# EAGLE schematic Inferno v1 (EAGLE 5.10)

## Sheet 1 of 7
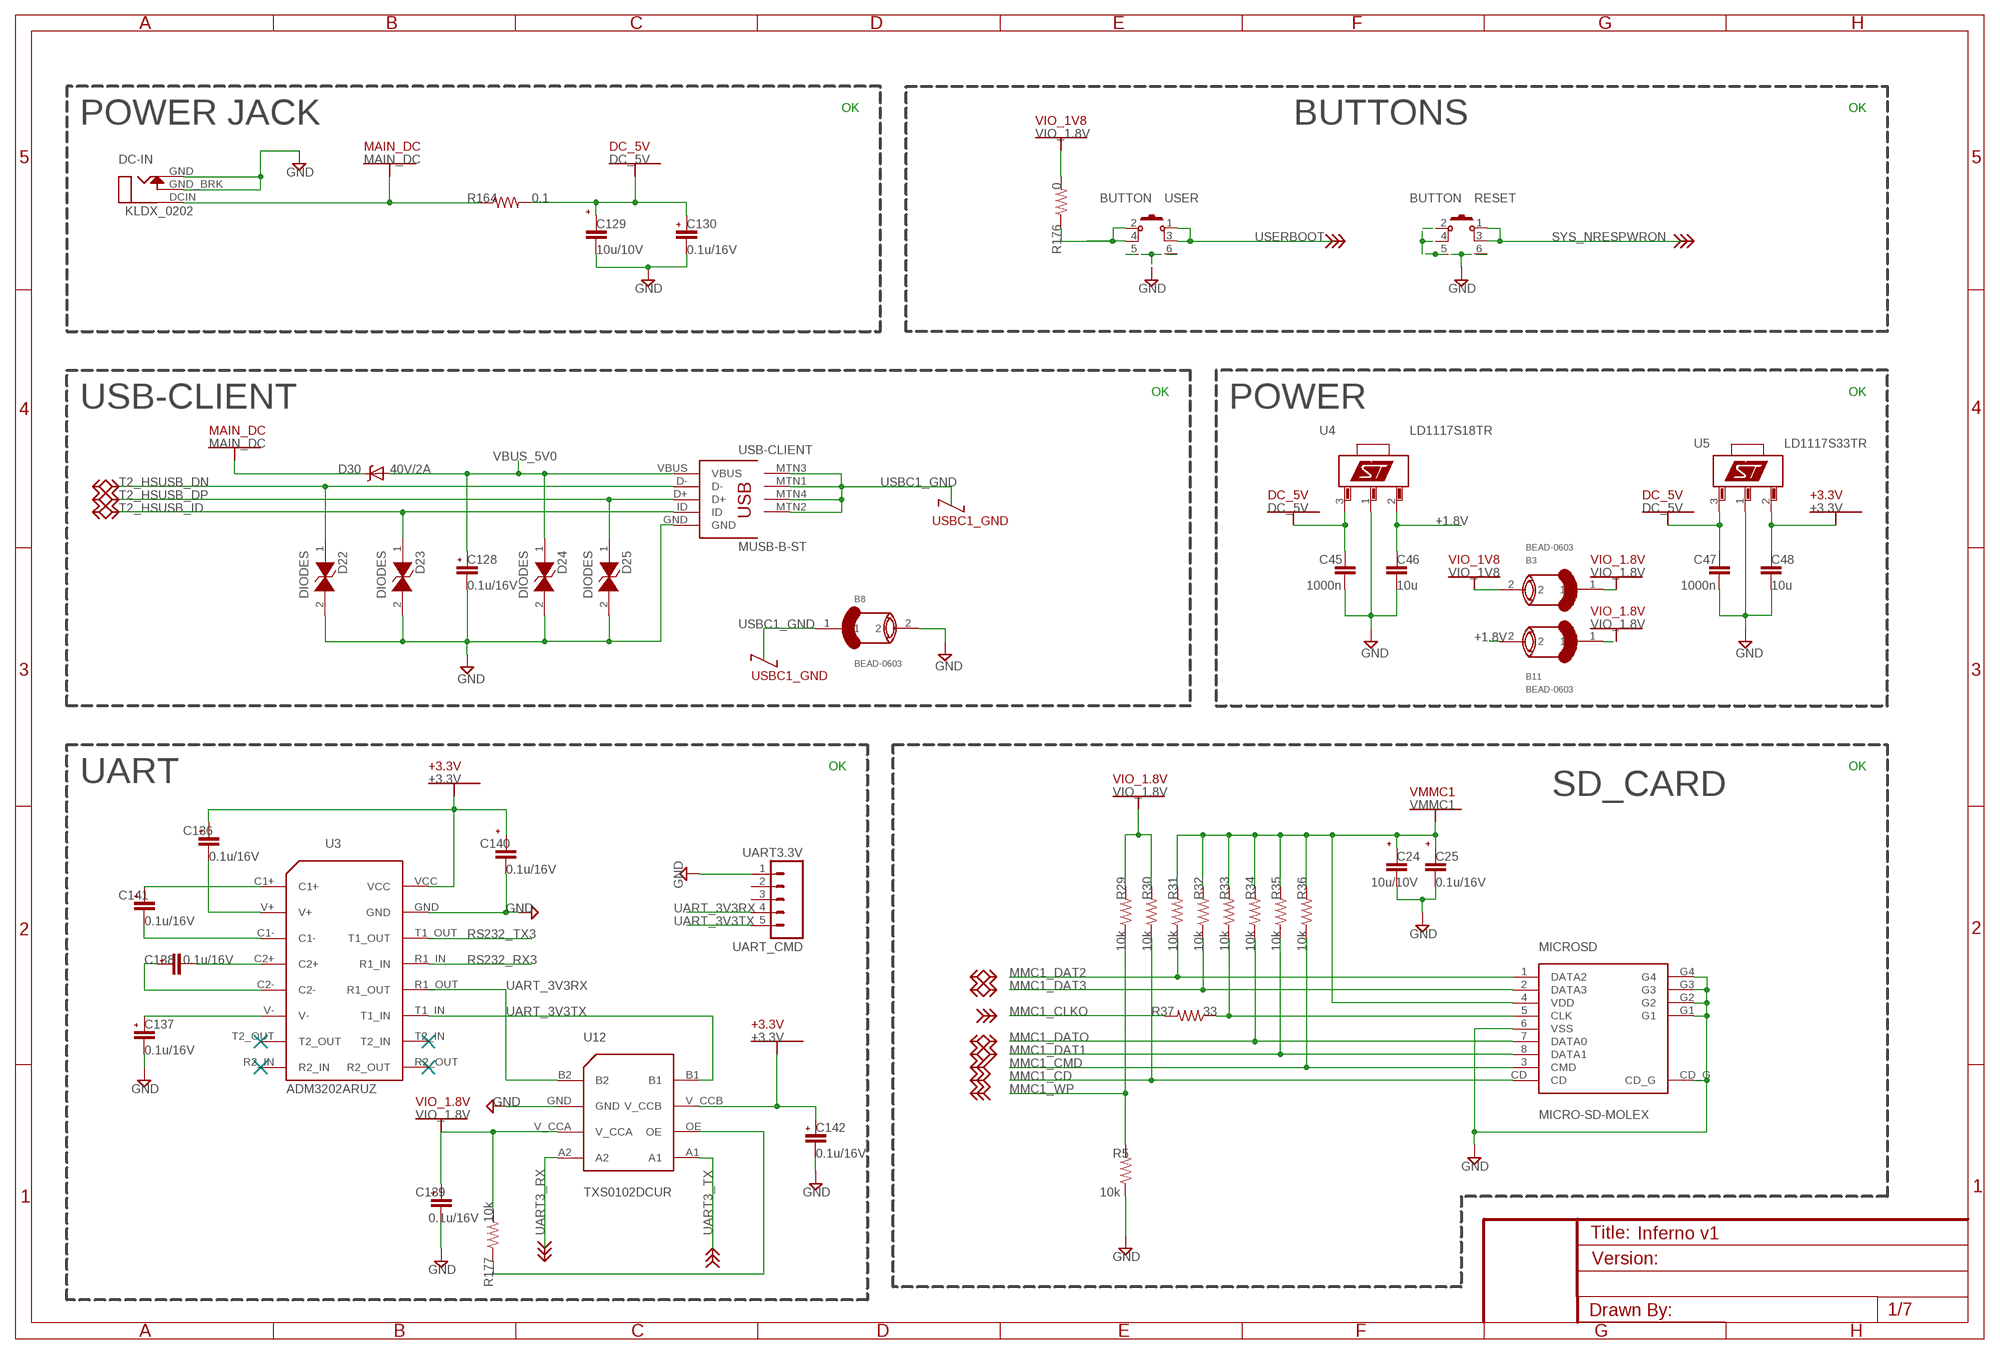
[diagram p0: schematic, sheet 1]

### Parts
B3  BEAD-0603  [0805]
B8  BEAD-0603  [0805]
B11  BEAD-0603  [0805]
C24  10u/10V  CAP0805  [0805]
C25  0.1u/16V  CAP0805  [0805]
C45  1000n  CAP0603-CAP  [0603-CAP]
C46  10u  CAP0603-CAP  [0603-CAP]
C47  1000n  CAP0603-CAP  [0603-CAP]
C48  10u  CAP0603-CAP  [0603-CAP]
C128  0.1u/16V  CAP0805  [0805]
C129  10u/10V  CAP0805  [0805]
C130  0.1u/16V  CAP0805  [0805]
C136  0.1u/16V  CAP0805  [0805]
C137  0.1u/16V  CAP0805  [0805]
C138  0.1u/16V  CAP0805  [0805]
C139  0.1u/16V  CAP0805  [0805]
C140  0.1u/16V  CAP0805  [0805]
C141  0.1u/16V  CAP0805  [0805]
C142  0.1u/16V  CAP0805  [0805]
D22  DIODES  [0603]
D23  DIODES  [0603]
D24  DIODES  [0603]
D25  DIODES  [0603]
D30  40V/2A  DIODE-SCHOTTKY_  [SMA-DIODE]
DC-IN  KLDX_0202  [KLDX_0202]
MICROSD  MICRO-SD-MOLEX  [MOLEX_MICROSD]
R5  10k  RESISTOR0603-RES  [0603-RES]
R29  10k  RESISTOR0603-RES  [0603-RES]
R30  10k  RESISTOR0603-RES  [0603-RES]
R31  10k  RESISTOR0603-RES  [0603-RES]
R32  10k  RESISTOR0603-RES  [0603-RES]
R33  10k  RESISTOR0603-RES  [0603-RES]
R34  10k  RESISTOR0603-RES  [0603-RES]
R35  10k  RESISTOR0603-RES  [0603-RES]
R36  10k  RESISTOR0603-RES  [0603-RES]
R37  33  RESISTOR0603-RES  [0603-RES]
R164  0.1  RESISTOR0603-RES  [0603-RES]
R176  0  RESISTOR0603-RES  [0603-RES]
R177  10k  RESISTOR0603-RES  [0603-RES]
RESET  BUTTON  TAC_SWITCH  [TACTILE-SW]
U3  ADM3202ARUZ  [TSSOP]
U4  LD1117S18TR  [SOT223]
U5  LD1117S33TR  [SOT223]
U12  TXS0102DCUR  [DCU]
UART_CMD  UART3.3V  M05PTH  [1X05]
USB-CLIENT  MUSB-B-ST  [USB-MINIB]
USER  BUTTON  TAC_SWITCH  [TACTILE-SW]

### Nets
+1.8V [net_VIO_1V8]: B11.2 C46.1 U4.2(VOUT)
+3.3V [net_+3.3V]: C48.1 C136.1 C140.1 C142.1 U3.VCC U5.2(VOUT) U12.V_CCB ; also sheet 4,5,7
DC_5V [net_DC_5V]: C45.1 C47.1 C129.1 C130.1 R164.2 U4.3(VIN) U5.3(VIN) ; also sheet 2,3,4,5,7
GND [net_GND]: B8.2 C24.2 C25.2 C45.2 C46.2 C47.2 C48.2 C128.2 C129.2 C130.2 C137.2 C139.2 C140.2 C142.2 D22.2 D23.2 D24.2 D25.2 DC-IN.GND DC-IN.GND_BRK MICROSD.6(VSS) MICROSD.CD_G MICROSD.G1 MICROSD.G2 MICROSD.G3 MICROSD.G4 R5.1 RESET.2 RESET.4 RESET.5(MNT1) RESET.6(MNT2) U3.GND U4.1(GND) U5.1(GND) U12.GND UART_CMD.1 USB-CLIENT.GND USER.5(MNT1) USER.6(MNT2) ; also sheet 2,3,4,5,6,7
MAIN_DC [net_MAIN_DC]: D30.C DC-IN.DCIN R164.1
MMC1_CD: MICROSD.CD R30.1 ; also sheet 4
MMC1_CLKO: R37.2 ; also sheet 4
MMC1_CMD: MICROSD.3(CMD) R36.1 ; also sheet 4
MMC1_DAT1: MICROSD.8(DATA1) R35.1 ; also sheet 4
MMC1_DAT2: MICROSD.1(DATA2) R31.1 ; also sheet 4
MMC1_DAT3: MICROSD.2(DATA3) R32.1 ; also sheet 4
MMC1_DATO: MICROSD.7(DATA0) R34.1 ; also sheet 4
MMC1_WP: R5.2 R29.1 ; also sheet 4
N$4: C141.1 U3.C1+
N$18: C141.2 U3.C1-
N$37: C136.2 U3.V+
N$53: MICROSD.5(CLK) R33.1 R37.1
N$55: C138.1 U3.C2+
N$56: C137.1 U3.V-
N$57: R177.1 U12.OE
N$58: C138.2 U3.C2-
N$188: R176.1 USER.2 USER.4
RS232_RX3: U3.R1_IN ; also sheet 4
RS232_TX3: U3.T1_OUT ; also sheet 4
SYS_NRESPWRON: RESET.1 RESET.3 ; also sheet 3,4,6
T2_HSUSB_DN: D22.1 USB-CLIENT.D- ; also sheet 4
T2_HSUSB_DP: D25.1 USB-CLIENT.D+ ; also sheet 4
T2_HSUSB_ID: D23.1 USB-CLIENT.ID ; also sheet 4
UART3_RX: U12.A2 ; also sheet 4
UART3_TX: U12.A1 ; also sheet 4
UART_3V3RX: U3.R1_OUT U12.B2 UART_CMD.4
UART_3V3TX: U3.T1_IN U12.B1 UART_CMD.5
USBC1_GND [net_USBC1_GND]: B8.1 USB-CLIENT.MTN1(MNT1) USB-CLIENT.MTN2(MNT2) USB-CLIENT.MTN3(MNT3) USB-CLIENT.MTN4(MNT4)
USERBOOT: USER.1 USER.3 ; also sheet 4
VBUS_5V0 [net_DC_5V]: C128.1 D24.1 D30.A USB-CLIENT.VBUS ; also sheet 4
VIO_1.8V [net_VIO_1V8]: B3.1 B11.1 C139.1 R29.2 R30.2 R176.2 R177.2 U12.V_CCA ; also sheet 3,4,5,6,7
VIO_1V8 [net_VIO_1V8]: B3.2 ; also sheet 4
VMMC1: C24.1 C25.1 MICROSD.4(VDD) R31.2 R32.2 R33.2 R34.2 R35.2 R36.2 ; also sheet 4
Unconnected: U3.R2_IN U3.R2_OUT U3.T2_IN U3.T2_OUT UART_CMD.2 UART_CMD.3

### Notes on the sheet
- OK | OK
- POWER JACK | BUTTONS
- OK | OK
- USB-CLIENT | POWER
- OK | OK
- UART
- SD_CARD

## Sheet 2 of 7
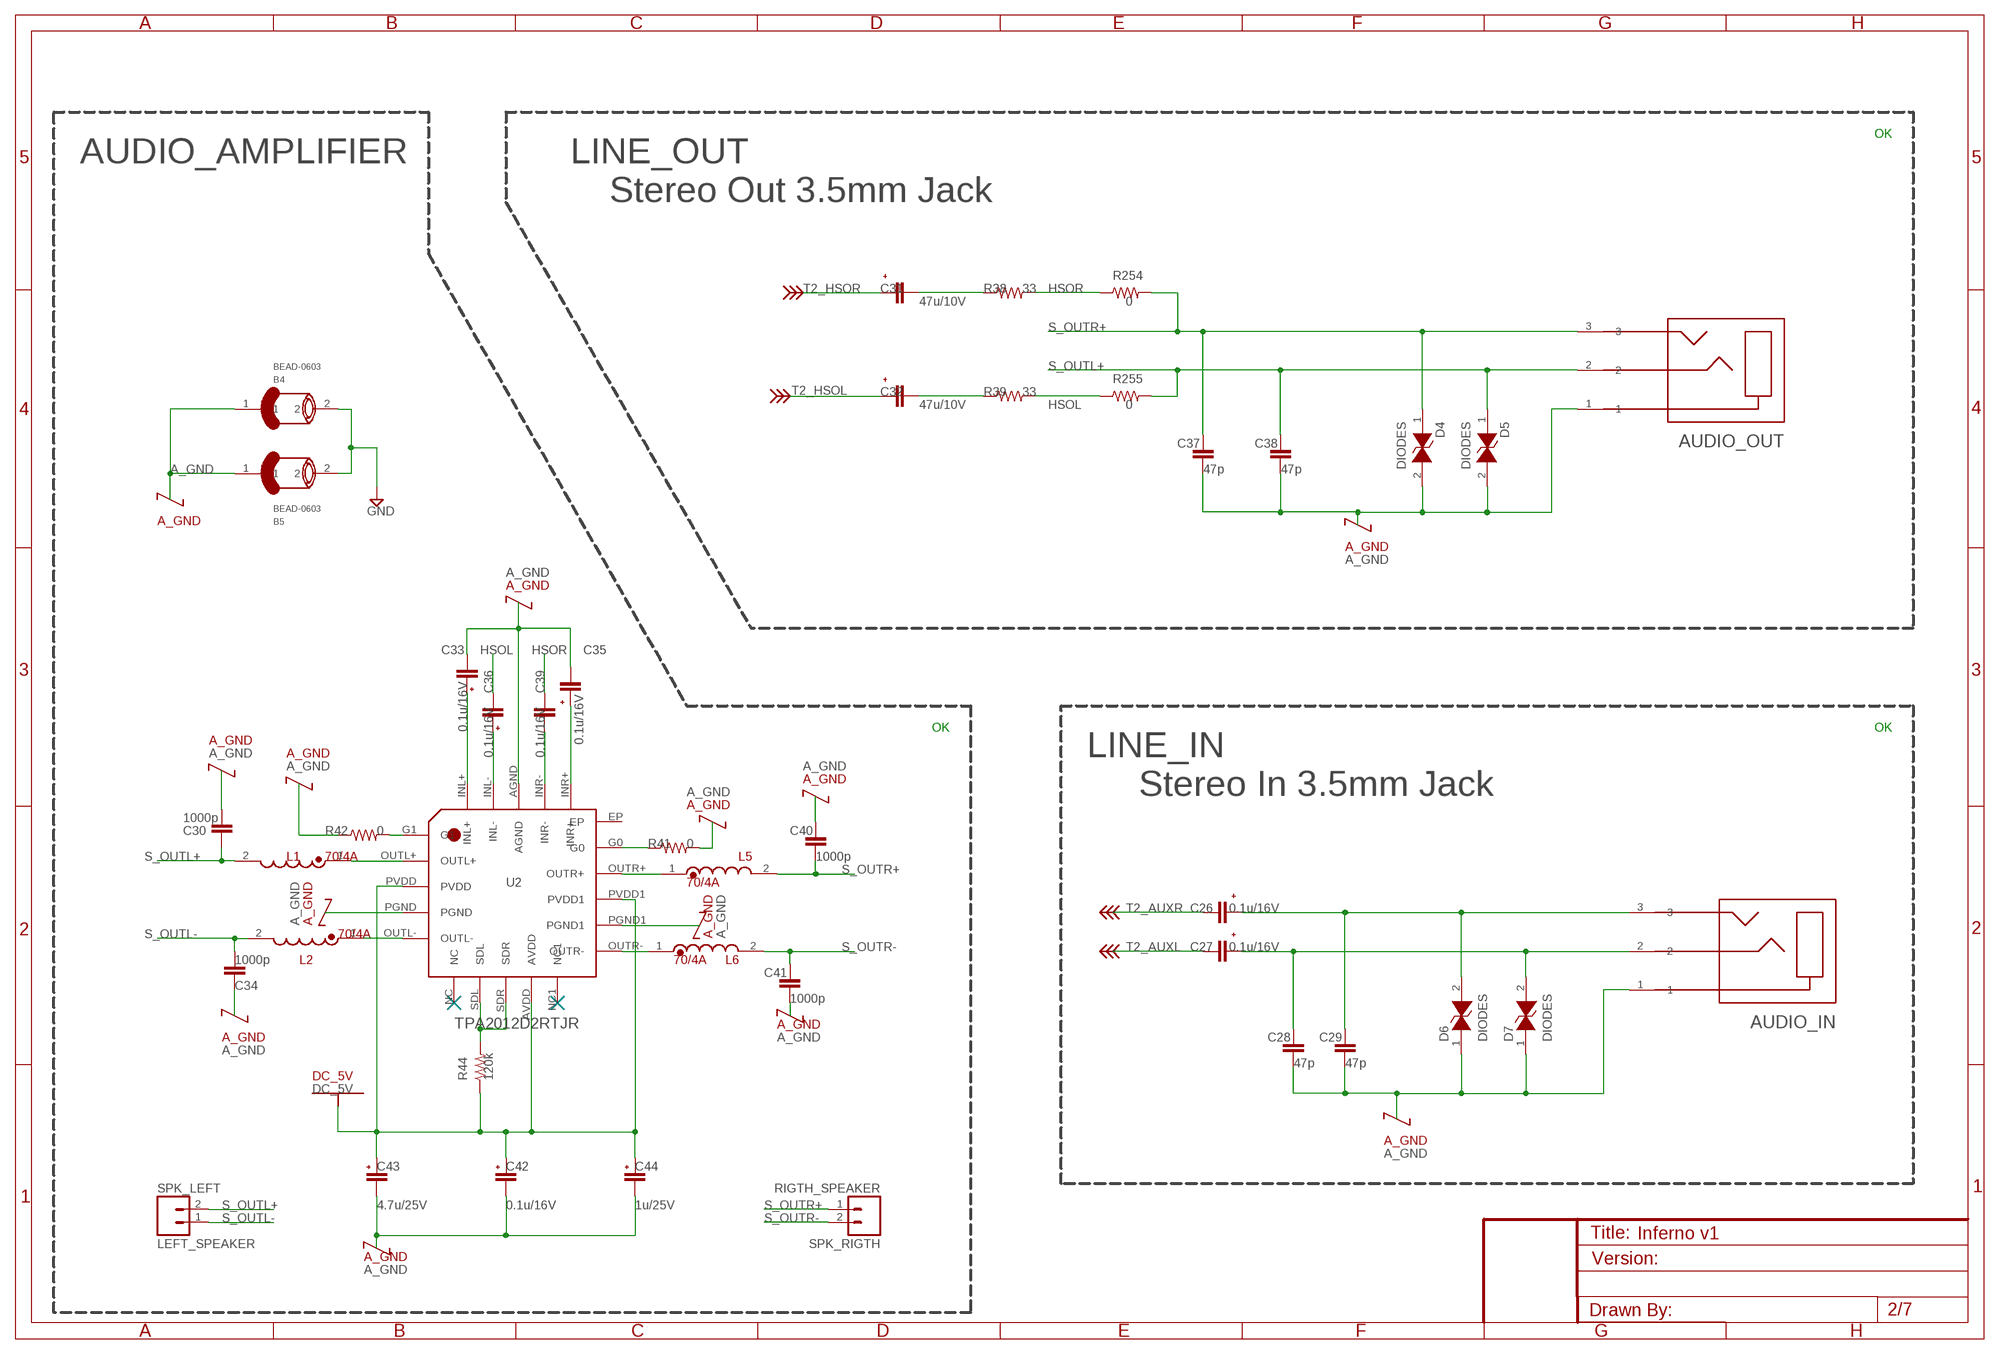
[diagram p1: schematic, sheet 2]

### Parts
AUDIO_IN  STX-300  [AUDIO-JACK]
AUDIO_OUT  STX-300  [AUDIO-JACK]
B4  BEAD-0603  [0805]
B5  BEAD-0603  [0805]
C26  0.1u/16V  CAP0805  [0805]
C27  0.1u/16V  CAP0805  [0805]
C28  47p  CAP0603-CAP  [0603-CAP]
C29  47p  CAP0603-CAP  [0603-CAP]
C30  1000p  CAP0603-CAP  [0603-CAP]
C31  47u/10V  CAP0805  [0805]
C32  47u/10V  CAP0805  [0805]
C33  0.1u/16V  CAP0805  [0805]
C34  1000p  CAP0603-CAP  [0603-CAP]
C35  0.1u/16V  CAP0805  [0805]
C36  0.1u/16V  CAP0805  [0805]
C37  47p  CAP0603-CAP  [0603-CAP]
C38  47p  CAP0603-CAP  [0603-CAP]
C39  0.1u/16V  CAP0805  [0805]
C40  1000p  CAP0603-CAP  [0603-CAP]
C41  1000p  CAP0603-CAP  [0603-CAP]
C42  0.1u/16V  CAP0805  [0805]
C43  4.7u/25V  CAP1206  [1206]
C44  1u/25V  CAP0805  [0805]
D4  DIODES  [0603]
D5  DIODES  [0603]
D6  DIODES  [0603]
D7  DIODES  [0603]
L1  70/4A  L  [0603]
L2  70/4A  L  [0603]
L5  70/4A  L  [0603]
L6  70/4A  L  [0603]
R38  33  RESISTOR0603-RES  [0603-RES]
R39  33  RESISTOR0603-RES  [0603-RES]
R41  0  RESISTOR0603-RES  [0603-RES]
R42  0  RESISTOR0603-RES  [0603-RES]
R44  120k  RESISTOR0603-RES  [0603-RES]
R254  0  RESISTOR0603-RES  [0603-RES]
R255  0  RESISTOR0603-RES  [0603-RES]
SPK_LEFT  LEFT_SPEAKER  M02LOCK  [1X02_LOCK]
SPK_RIGTH  RIGTH_SPEAKER  M02LOCK  [1X02_LOCK]
U2  TPA2012D2RTJR  [RTJ]

### Nets
A_GND [net_A_GND]: AUDIO_IN.1 AUDIO_OUT.1 B4.1 B5.1 C28.2 C29.2 C30.2 C33.2 C34.1 C35.2 C37.2 C38.2 C40.2 C41.1 C42.2 C43.2 C44.2 D4.2 D5.2 D6.1 D7.1 R41.2 R42.1 U2.AGND U2.PGND U2.PGND1
DC_5V [net_DC_5V]: C42.1 C43.1 C44.1 R44.1 U2.AVDD U2.PVDD U2.PVDD1 ; also sheet 1,3,4,5,7
GND [net_GND]: B4.2 B5.2 ; also sheet 1,3,4,5,6,7
HSOL: C36.2 R39.2 R255.1
HSOR: C39.2 R38.2 R254.1
N$13: C33.1 U2.INL+
N$16: R42.2 U2.G1
N$24: R44.2 U2.SDL U2.SDR
N$25: L6.1 U2.OUTR-
N$26: L5.1 U2.OUTR+
N$27: L1.1 U2.OUTL+
N$28: L2.1 U2.OUTL-
N$29: C36.1 U2.INL-
N$30: C39.1 U2.INR-
N$32: C35.1 U2.INR+
N$33: R41.1 U2.G0
N$38: AUDIO_IN.3 C26.1 C29.1 D6.2
N$40: AUDIO_IN.2 C27.1 C28.1 D7.2
N$48: C31.2 R38.1
N$51: C32.2 R39.1
S_OUTL+: AUDIO_OUT.2 C30.1 C38.1 D5.1 L1.2 R255.2 SPK_LEFT.2
S_OUTL-: C34.2 L2.2 SPK_LEFT.1
S_OUTR+: AUDIO_OUT.3 C37.1 C40.1 D4.1 L5.2 R254.2 SPK_RIGTH.1
S_OUTR-: C41.2 L6.2 SPK_RIGTH.2
T2_AUXL: C27.2 ; also sheet 4
T2_AUXR: C26.2 ; also sheet 4
T2_HSOL: C32.1 ; also sheet 4
T2_HSOR: C31.1 ; also sheet 4
Unconnected: U2.EP U2.NC U2.NC1

### Notes on the sheet
- OK
- AUDIO_AMPLIFIER | LINE_OUT
- Stereo Out 3.5mm Jack
- OK | OK
- LINE_IN
- Stereo In 3.5mm Jack

## Sheet 3 of 7
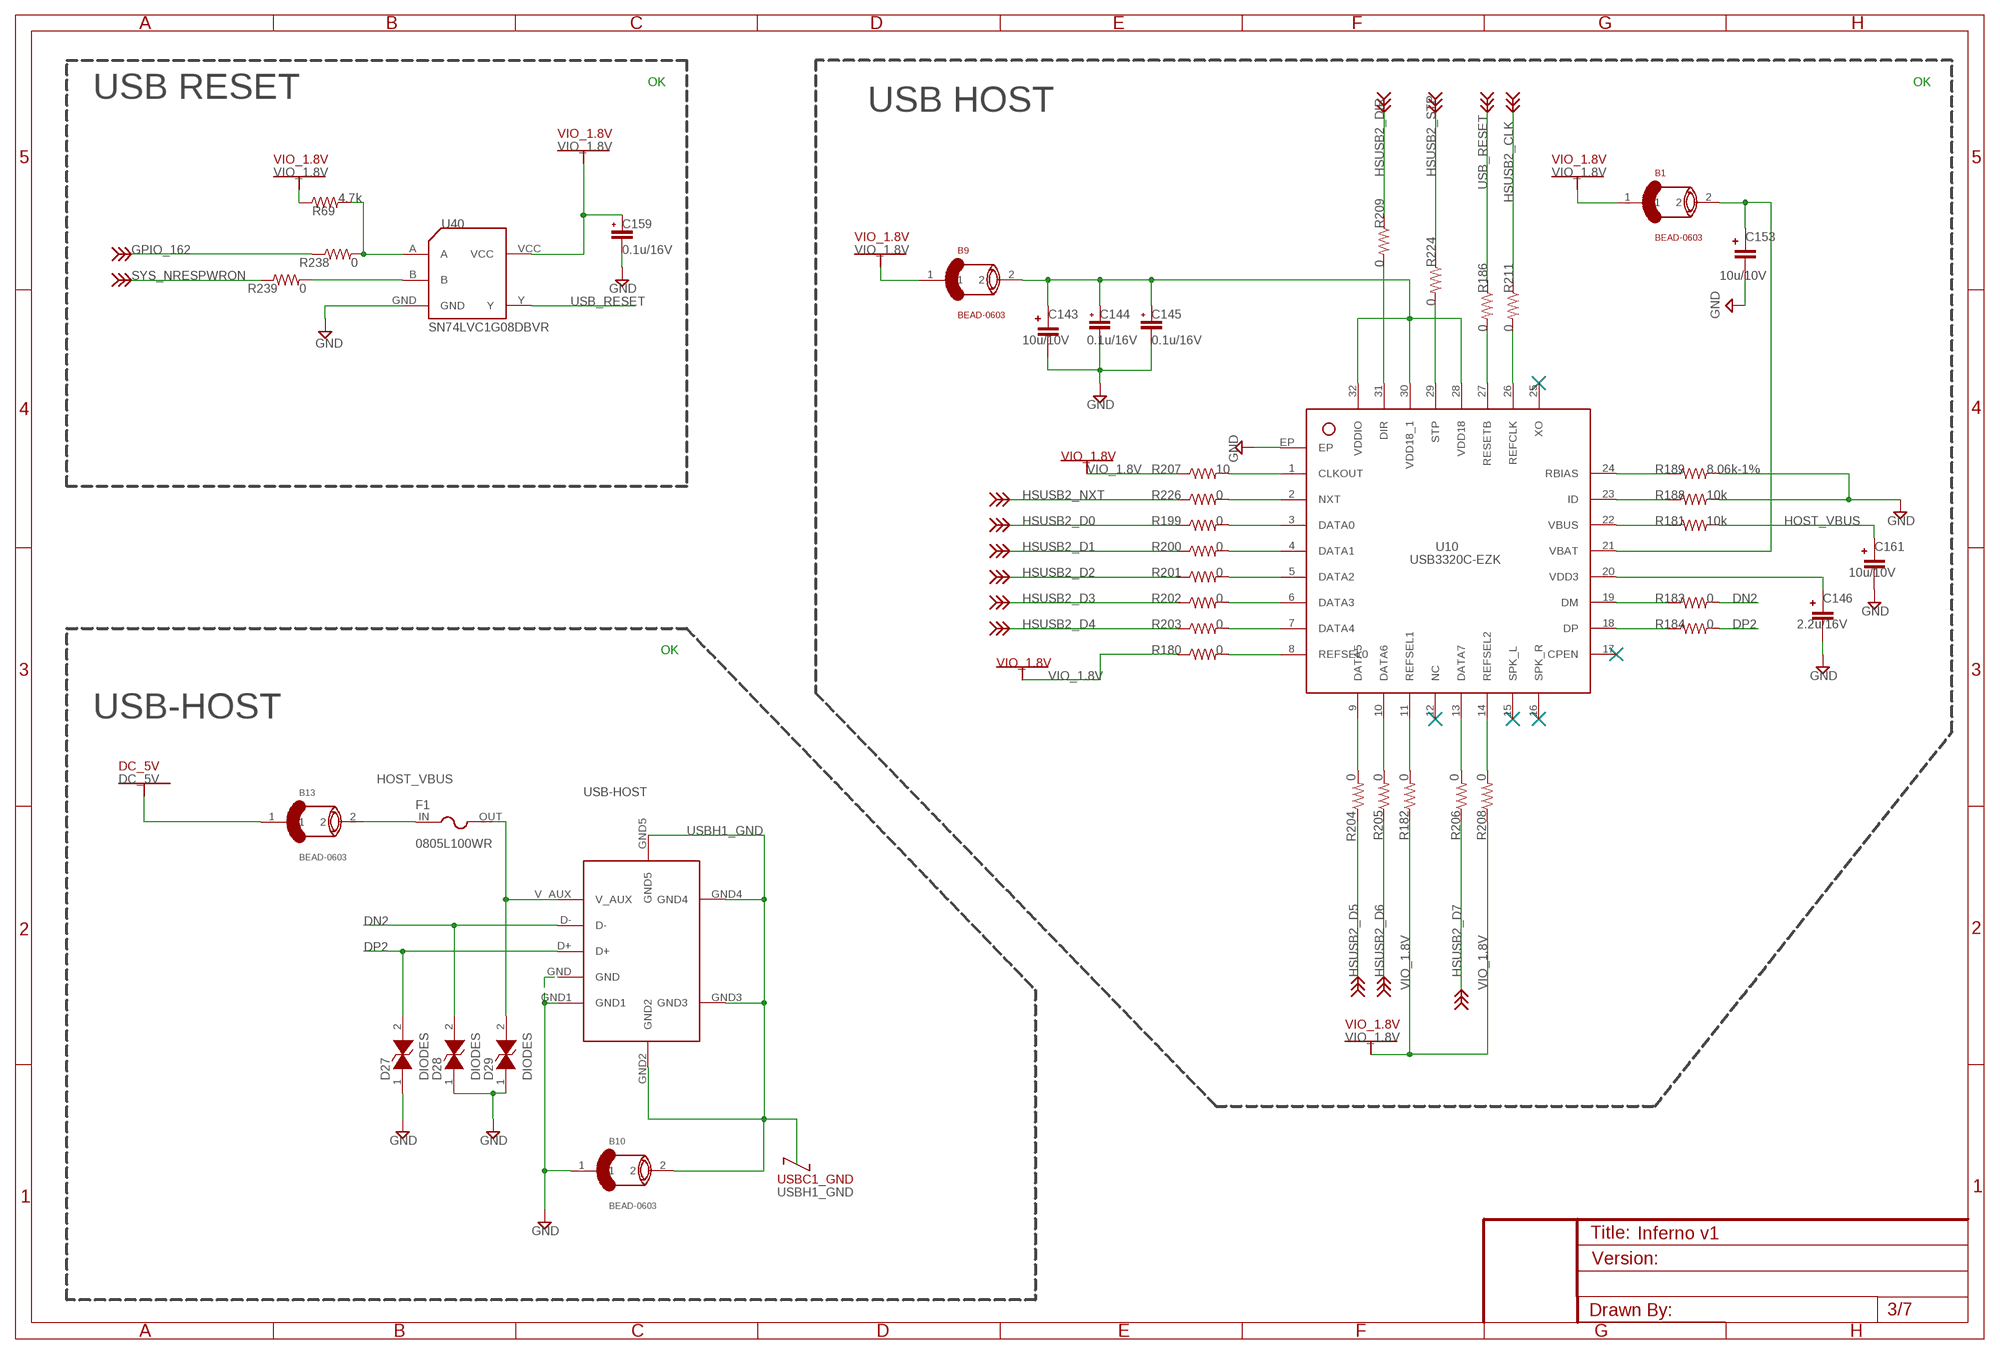
[diagram p2: schematic, sheet 3]

### Parts
B1  BEAD-0603  [0805]
B9  BEAD-0603  [0805]
B10  BEAD-0603  [0805]
B13  BEAD-0603  [0805]
C143  10u/10V  CAP-E-SMD  [0603-CAP]
C144  0.1u/16V  CAP0805  [0805]
C145  0.1u/16V  CAP0805  [0805]
C146  2.2u/16V  CAP-E-SMD  [0603-CAP]
C153  10u/10V  CAP-E-SMD  [0603-CAP]
C159  0.1u/16V  CAP0805  [0805]
C161  10u/10V  CAP-E-SMD  [0603-CAP]
D27  DIODES  [0603]
D28  DIODES  [0603]
D29  DIODES  [0603]
F1  0805L100WR  [SMD0805-100]
R69  4.7k  RESISTOR0603-RES  [0603-RES]
R180  0  RESISTOR0603-RES  [0603-RES]
R181  10k  RESISTOR0603-RES  [0603-RES]
R182  0  RESISTOR0603-RES  [0603-RES]
R183  0  RESISTOR0603-RES  [0603-RES]
R184  0  RESISTOR0603-RES  [0603-RES]
R186  0  RESISTOR0603-RES  [0603-RES]
R188  10k  RESISTOR0603-RES  [0603-RES]
R189  8.06k-1%  RESISTOR0603-RES  [0603-RES]
R199  0  RESISTOR0603-RES  [0603-RES]
R200  0  RESISTOR0603-RES  [0603-RES]
R201  0  RESISTOR0603-RES  [0603-RES]
R202  0  RESISTOR0603-RES  [0603-RES]
R203  0  RESISTOR0603-RES  [0603-RES]
R204  0  RESISTOR0603-RES  [0603-RES]
R205  0  RESISTOR0603-RES  [0603-RES]
R206  0  RESISTOR0603-RES  [0603-RES]
R207  10  RESISTOR0603-RES  [0603-RES]
R208  0  RESISTOR0603-RES  [0603-RES]
R209  0  RESISTOR0603-RES  [0603-RES]
R211  0  RESISTOR0603-RES  [0603-RES]
R224  0  RESISTOR0603-RES  [0603-RES]
R226  0  RESISTOR0603-RES  [0603-RES]
R238  0  RESISTOR0603-RES  [0603-RES]
R239  0  RESISTOR0603-RES  [0603-RES]
U10  USB3320C-EZK  [QFN-32]
U40  SN74LVC1G08DBVR  [SOT-23-DBV]
USB-HOST  MINI-USB-A-S-RA  [MINI-USB-A]

### Nets
DC_5V [net_DC_5V]: B13.1 ; also sheet 1,2,4,5,7
DN2: D28.2 R183.2 USB-HOST.D-
DP2: D27.2 R184.2 USB-HOST.D+
GND [net_GND]: B10.1 C143.2 C144.2 C145.2 C146.2 C153.2 C159.2 C161.2 D27.1 D28.1 D29.1 R188.2 R189.2 U10.EP U40.GND USB-HOST.GND USB-HOST.GND1 ; also sheet 1,2,4,5,6,7
GPIO_162: R238.1 ; also sheet 4
HOST_VBUS: B13.2 C161.1 F1.IN R181.2
HSUSB2_CLK: R211.1 ; also sheet 4
HSUSB2_D0: R199.1 ; also sheet 4
HSUSB2_D1: R200.1 ; also sheet 4
HSUSB2_D2: R201.1 ; also sheet 4
HSUSB2_D3: R202.1 ; also sheet 4
HSUSB2_D4: R203.1 ; also sheet 4
HSUSB2_D5: R204.1 ; also sheet 4
HSUSB2_D6: R205.1 ; also sheet 4
HSUSB2_D7: R206.1 ; also sheet 4
HSUSB2_DIR: R209.1 ; also sheet 4
HSUSB2_NXT: R226.1 ; also sheet 4
HSUSB2_STP: R224.1 ; also sheet 4
N$1: D29.2 F1.OUT USB-HOST.V_AUX
N$2: R226.2 U10.2(NXT)
N$3: R199.2 U10.3(DATA0)
N$5: R200.2 U10.4(DATA1)
N$6: R201.2 U10.5(DATA2)
N$7: R202.2 U10.6(DATA3)
N$8: R203.2 U10.7(DATA4)
N$9: R180.2 U10.8(REFSEL0)
N$10: R204.2 U10.9(DATA5)
N$11: R183.1 U10.19(DM)
N$12: R184.1 U10.18(DP)
N$14: B1.2 C153.1 U10.21(VBAT)
N$15: R205.2 U10.10(DATA6)
N$17: R182.2 U10.11(REFSEL1)
N$19: R206.2 U10.13(DATA7)
N$20: R208.2 U10.14(REFSEL2)
N$21: R186.2 U10.27(RESETB)
N$22: R211.2 U10.26(REFCLK)
N$23: R209.2 U10.31(DIR)
N$31: R224.2 U10.29(STP)
N$39: R69.2 R238.2 U40.A
N$52: R239.2 U40.B
N$202: R207.2 U10.1(CLKOUT)
N$230: C146.1 U10.20(VDD3)
N$231: R181.1 U10.22(VBUS)
N$233: R188.1 U10.23(ID)
N$234: R189.1 U10.24(RBIAS)
N$239: B9.2 C143.1 C144.1 C145.1 U10.28(VDD18) U10.30(VDD18_1) U10.32(VDDIO)
SYS_NRESPWRON: R239.1 ; also sheet 1,4,6
USB_RESET: R186.1 U40.Y
USBH1_GND [net_USBC1_GND]: B10.2 USB-HOST.GND2 USB-HOST.GND3 USB-HOST.GND4 USB-HOST.GND5
VIO_1.8V [net_VIO_1V8]: B1.1 B9.1 C159.1 R69.1 R180.1 R182.1 R207.1 R208.1 U40.VCC ; also sheet 1,4,5,6,7
Unconnected: U10.12(NC) U10.15(SPK_L) U10.16(SPK_R) U10.17(CPEN) U10.25(XO)

### Notes on the sheet
- OK | OK
- USB RESET
- USB HOST
- OK
- USB-HOST

## Sheet 4 of 7
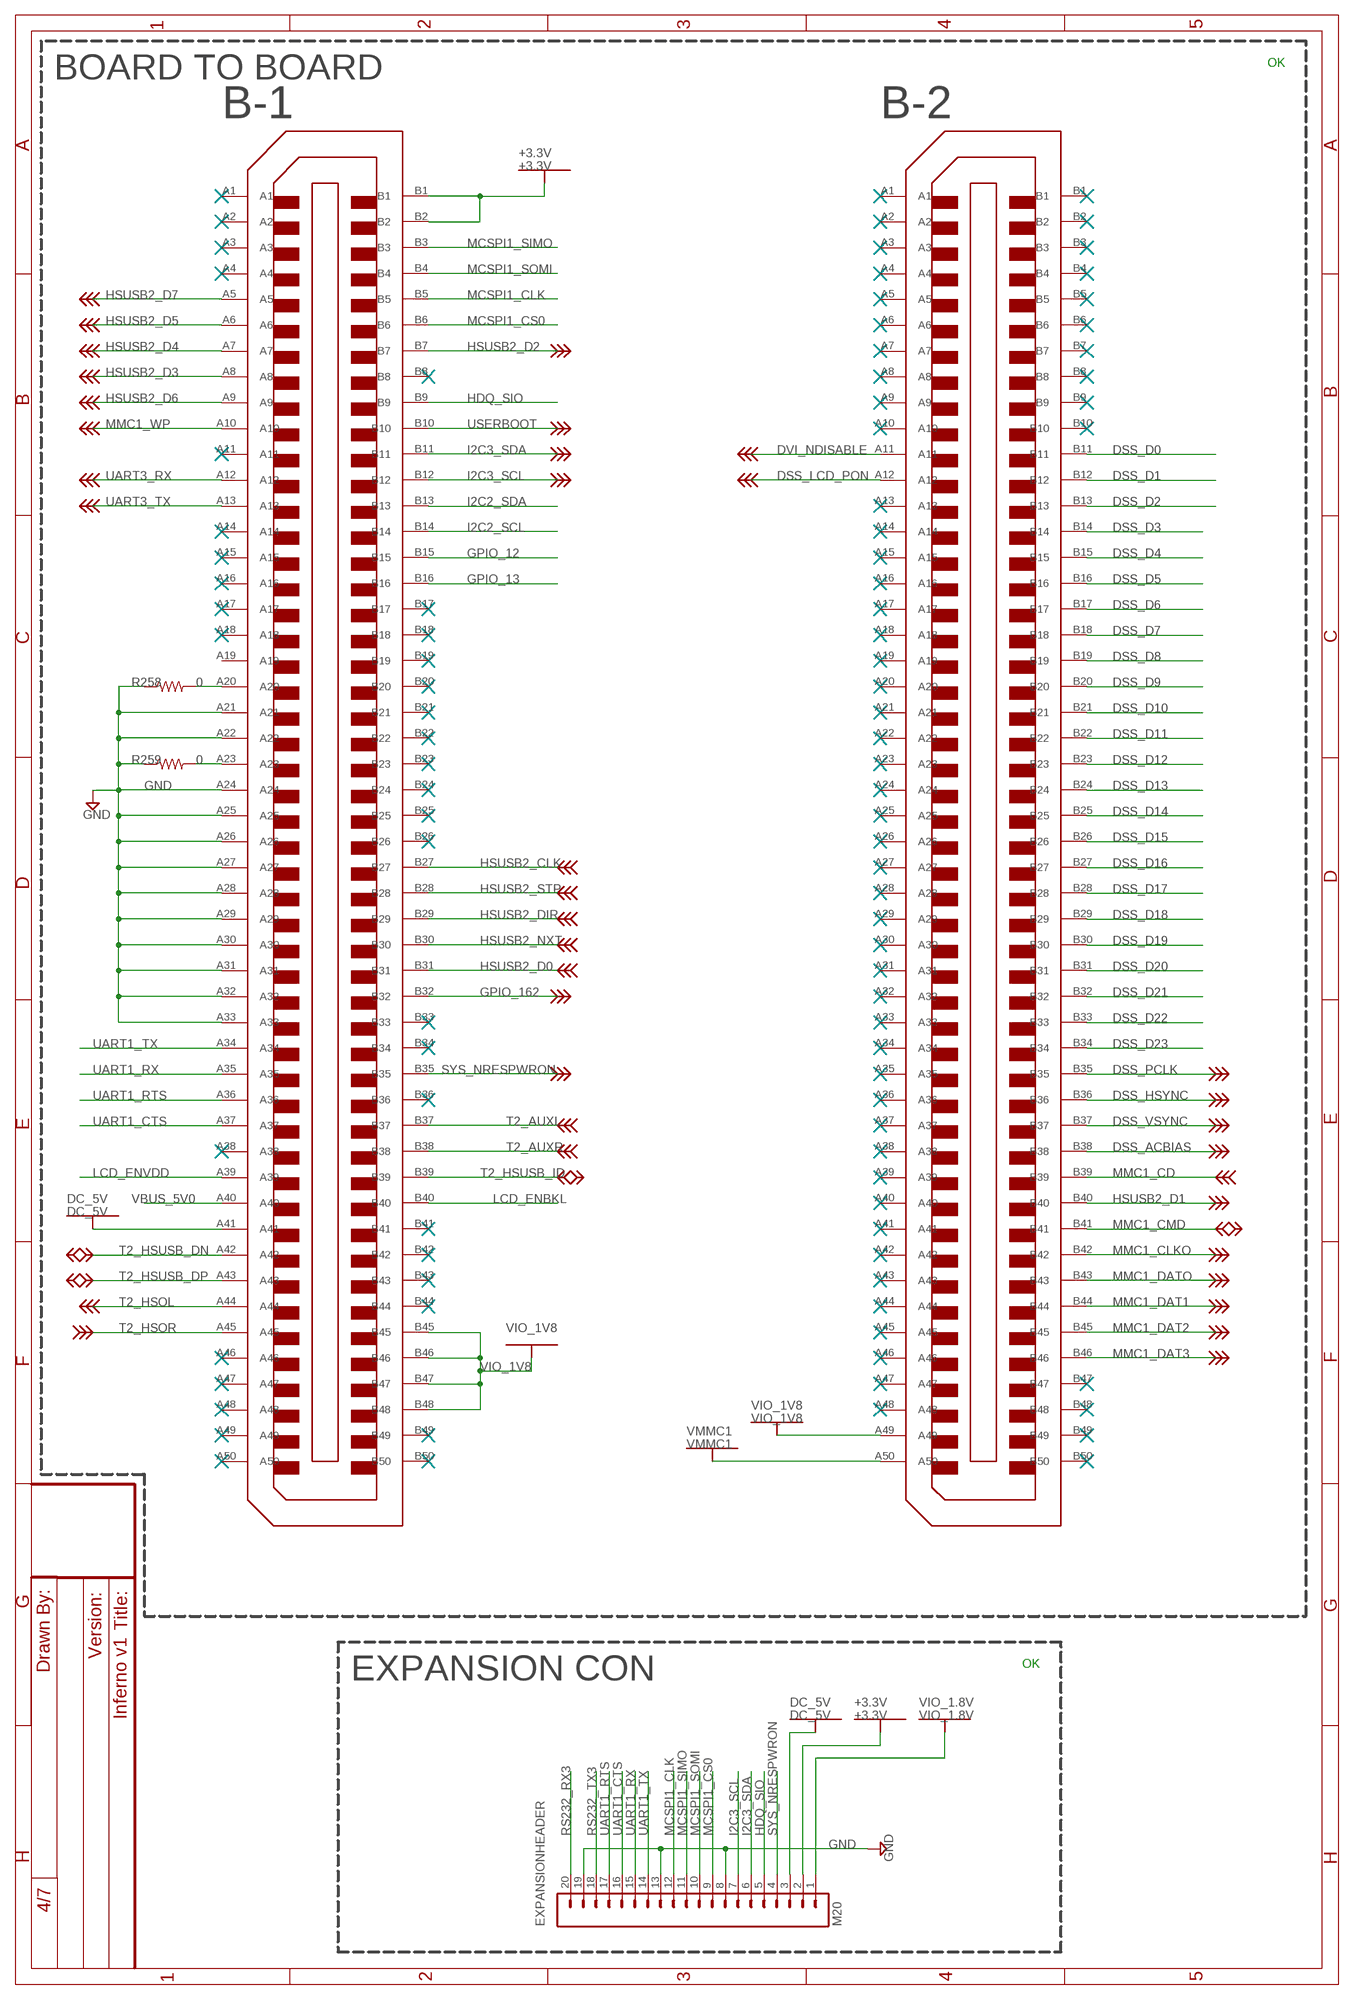
[diagram p3: schematic, sheet 4]

### Parts
B-1  AXK5S00247YG  [AXK-SOCKET]
B-2  AXK5S00247YG  [AXK-SOCKET]
EXPANSIONHEADER  M20  [1X20]
R258  0  RESISTOR0603-RES  [0603-RES]
R259  0  RESISTOR0603-RES  [0603-RES]

### Nets
+3.3V [net_+3.3V]: B-1.B1 B-1.B2 EXPANSIONHEADER.2 ; also sheet 1,5,7
DC_5V [net_DC_5V]: B-1.A41 EXPANSIONHEADER.3 ; also sheet 1,2,3,5,7
DSS_ACBIAS: B-2.B38 ; also sheet 5,6
DSS_D0: B-2.B11 ; also sheet 5,6
DSS_D1: B-2.B12 ; also sheet 5,6
DSS_D2: B-2.B13 ; also sheet 5,6
DSS_D3: B-2.B14 ; also sheet 5,6
DSS_D4: B-2.B15 ; also sheet 5,6
DSS_D5: B-2.B16 ; also sheet 5,6
DSS_D6: B-2.B17 ; also sheet 5,6
DSS_D7: B-2.B18 ; also sheet 5,6
DSS_D8: B-2.B19 ; also sheet 5,6
DSS_D9: B-2.B20 ; also sheet 5,6
DSS_D10: B-2.B21 ; also sheet 5,6
DSS_D11: B-2.B22 ; also sheet 5,6
DSS_D12: B-2.B23 ; also sheet 5,6
DSS_D13: B-2.B24 ; also sheet 5,6
DSS_D14: B-2.B25 ; also sheet 5,6
DSS_D15: B-2.B26 ; also sheet 5,6
DSS_D16: B-2.B27 ; also sheet 5,6
DSS_D17: B-2.B28 ; also sheet 5,6
DSS_D18: B-2.B29 ; also sheet 5,6
DSS_D19: B-2.B30 ; also sheet 5,6
DSS_D20: B-2.B31 ; also sheet 5,6
DSS_D21: B-2.B32 ; also sheet 5,6
DSS_D22: B-2.B33 ; also sheet 5,6
DSS_D23: B-2.B34 ; also sheet 5,6
DSS_HSYNC: B-2.B36 ; also sheet 5,6
DSS_LCD_PON: B-2.A12 ; also sheet 6
DSS_PCLK: B-2.B35 ; also sheet 5,6
DSS_VSYNC: B-2.B37 ; also sheet 5,6
DVI_NDISABLE: B-2.A11 ; also sheet 5,6
GND [net_GND]: B-1.A21 B-1.A22 B-1.A24 B-1.A25 B-1.A26 B-1.A27 B-1.A28 B-1.A29 B-1.A30 B-1.A31 B-1.A32 B-1.A33 EXPANSIONHEADER.8 EXPANSIONHEADER.13 EXPANSIONHEADER.19 R258.1 R259.1 ; also sheet 1,2,3,5,6,7
GPIO_12: B-1.B15 ; also sheet 7
GPIO_13: B-1.B16 ; also sheet 7
GPIO_162: B-1.B32 ; also sheet 3
HDQ_SIO: B-1.B9 EXPANSIONHEADER.5
HSUSB2_CLK: B-1.B27 ; also sheet 3
HSUSB2_D0: B-1.B31 ; also sheet 3
HSUSB2_D1: B-2.B40 ; also sheet 3
HSUSB2_D2: B-1.B7 ; also sheet 3
HSUSB2_D3: B-1.A8 ; also sheet 3
HSUSB2_D4: B-1.A7 ; also sheet 3
HSUSB2_D5: B-1.A6 ; also sheet 3
HSUSB2_D6: B-1.A9 ; also sheet 3
HSUSB2_D7: B-1.A5 ; also sheet 3
HSUSB2_DIR: B-1.B29 ; also sheet 3
HSUSB2_NXT: B-1.B30 ; also sheet 3
HSUSB2_STP: B-1.B28 ; also sheet 3
I2C2_SCL: B-1.B14 ; also sheet 7
I2C2_SDA: B-1.B13 ; also sheet 7
I2C3_SCL: B-1.B12 EXPANSIONHEADER.7 ; also sheet 5
I2C3_SDA: B-1.B11 EXPANSIONHEADER.6 ; also sheet 5
LCD_ENBKL: B-1.B40 ; also sheet 7
LCD_ENVDD: B-1.A39 ; also sheet 7
MCSPI1_CLK: B-1.B5 EXPANSIONHEADER.12
MCSPI1_CS0: B-1.B6 EXPANSIONHEADER.9
MCSPI1_SIMO: B-1.B3 EXPANSIONHEADER.11
MCSPI1_SOMI: B-1.B4 EXPANSIONHEADER.10
MMC1_CD: B-2.B39 ; also sheet 1
MMC1_CLKO: B-2.B42 ; also sheet 1
MMC1_CMD: B-2.B41 ; also sheet 1
MMC1_DAT1: B-2.B44 ; also sheet 1
MMC1_DAT2: B-2.B45 ; also sheet 1
MMC1_DAT3: B-2.B46 ; also sheet 1
MMC1_DATO: B-2.B43 ; also sheet 1
MMC1_WP: B-1.A10 ; also sheet 1
N$34: B-1.A20 R258.2
N$36: B-1.A23 R259.2
RS232_RX3: EXPANSIONHEADER.20 ; also sheet 1
RS232_TX3: EXPANSIONHEADER.18 ; also sheet 1
SYS_NRESPWRON: B-1.B35 EXPANSIONHEADER.4 ; also sheet 1,3,6
T2_AUXL: B-1.B37 ; also sheet 2
T2_AUXR: B-1.B38 ; also sheet 2
T2_HSOL: B-1.A44 ; also sheet 2
T2_HSOR: B-1.A45 ; also sheet 2
T2_HSUSB_DN: B-1.A42 ; also sheet 1
T2_HSUSB_DP: B-1.A43 ; also sheet 1
T2_HSUSB_ID: B-1.B39 ; also sheet 1
UART1_CTS: B-1.A37 EXPANSIONHEADER.16
UART1_RTS: B-1.A36 EXPANSIONHEADER.17
UART1_RX: B-1.A35 EXPANSIONHEADER.15
UART1_TX: B-1.A34 EXPANSIONHEADER.14
UART3_RX: B-1.A12 ; also sheet 1
UART3_TX: B-1.A13 ; also sheet 1
USERBOOT: B-1.B10 ; also sheet 1
VBUS_5V0 [net_DC_5V]: B-1.A40 ; also sheet 1
VIO_1.8V [net_VIO_1V8]: EXPANSIONHEADER.1 ; also sheet 1,3,5,6,7
VIO_1V8 [net_VIO_1V8]: B-1.B45 B-1.B46 B-1.B47 B-1.B48 B-2.A49 ; also sheet 1
VMMC1: B-2.A50 ; also sheet 1
Unconnected: B-1.A1 B-1.A2 B-1.A3 B-1.A4 B-1.A11 B-1.A14 B-1.A15 B-1.A16 B-1.A17 B-1.A18 B-1.A19 B-1.A38 B-1.A46 B-1.A47 B-1.A48 B-1.A49 B-1.A50 B-1.B8 B-1.B17 B-1.B18 B-1.B19 B-1.B20 B-1.B21 B-1.B22 B-1.B23 B-1.B24 B-1.B25 B-1.B26 B-1.B33 B-1.B34 B-1.B36 B-1.B41 B-1.B42 B-1.B43 B-1.B44 B-1.B49 B-1.B50 B-2.A1 B-2.A2 B-2.A3 B-2.A4 B-2.A5 B-2.A6 B-2.A7 B-2.A8 B-2.A9 B-2.A10 B-2.A13 B-2.A14 B-2.A15 B-2.A16 B-2.A17 B-2.A18 B-2.A19 B-2.A20 B-2.A21 B-2.A22 B-2.A23 B-2.A24 B-2.A25 B-2.A26 B-2.A27 B-2.A28 B-2.A29 B-2.A30 B-2.A31 B-2.A32 B-2.A33 B-2.A34 B-2.A35 B-2.A36 B-2.A37 B-2.A38 B-2.A39 B-2.A40 B-2.A41 B-2.A42 B-2.A43 B-2.A44 B-2.A45 B-2.A46 B-2.A47 B-2.A48 B-2.B1 B-2.B2 B-2.B3 B-2.B4 B-2.B5 B-2.B6 B-2.B7 B-2.B8 B-2.B9 B-2.B10 B-2.B47 B-2.B48 B-2.B49 B-2.B50

### Notes on the sheet
- OK
- BOARD TO BOARD
- OK
- EXPANSION CON

## Sheet 5 of 7
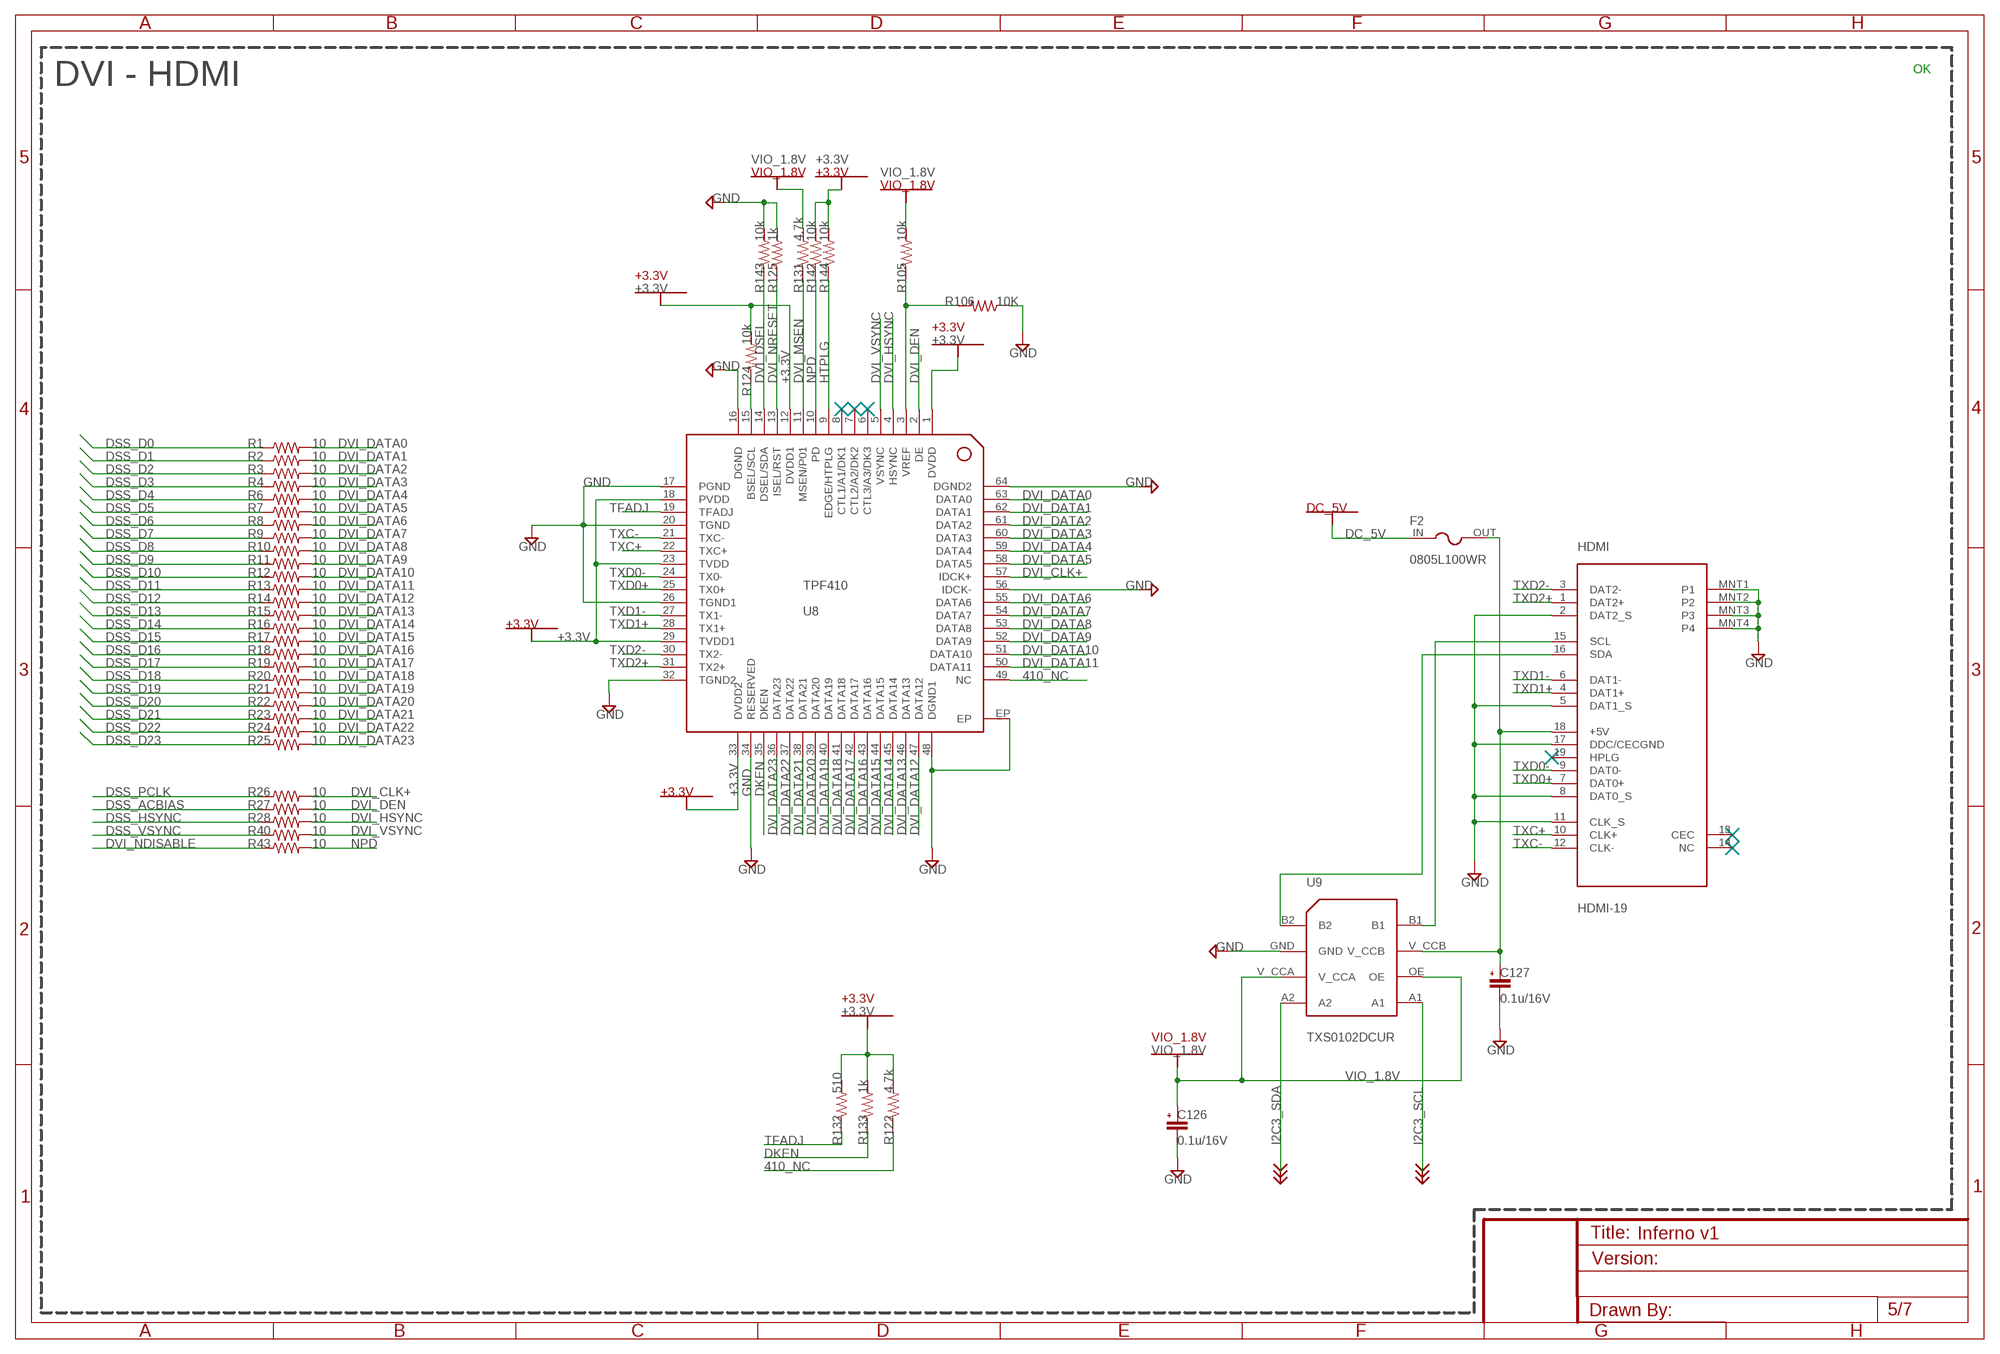
[diagram p4: schematic, sheet 5]

### Parts
C126  0.1u/16V  CAP0805  [0805]
C127  0.1u/16V  CAP0805  [0805]
F2  0805L100WR  [SMD0805-100]
HDMI  HDMI-19  [HDMI-19]
R1  10  RESISTOR0603-RES  [0603-RES]
R2  10  RESISTOR0603-RES  [0603-RES]
R3  10  RESISTOR0603-RES  [0603-RES]
R4  10  RESISTOR0603-RES  [0603-RES]
R6  10  RESISTOR0603-RES  [0603-RES]
R7  10  RESISTOR0603-RES  [0603-RES]
R8  10  RESISTOR0603-RES  [0603-RES]
R9  10  RESISTOR0603-RES  [0603-RES]
R10  10  RESISTOR0603-RES  [0603-RES]
R11  10  RESISTOR0603-RES  [0603-RES]
R12  10  RESISTOR0603-RES  [0603-RES]
R13  10  RESISTOR0603-RES  [0603-RES]
R14  10  RESISTOR0603-RES  [0603-RES]
R15  10  RESISTOR0603-RES  [0603-RES]
R16  10  RESISTOR0603-RES  [0603-RES]
R17  10  RESISTOR0603-RES  [0603-RES]
R18  10  RESISTOR0603-RES  [0603-RES]
R19  10  RESISTOR0603-RES  [0603-RES]
R20  10  RESISTOR0603-RES  [0603-RES]
R21  10  RESISTOR0603-RES  [0603-RES]
R22  10  RESISTOR0603-RES  [0603-RES]
R23  10  RESISTOR0603-RES  [0603-RES]
R24  10  RESISTOR0603-RES  [0603-RES]
R25  10  RESISTOR0603-RES  [0603-RES]
R26  10  RESISTOR0603-RES  [0603-RES]
R27  10  RESISTOR0603-RES  [0603-RES]
R28  10  RESISTOR0603-RES  [0603-RES]
R40  10  RESISTOR0603-RES  [0603-RES]
R43  10  RESISTOR0603-RES  [0603-RES]
R105  10k  RESISTOR0603-RES  [0603-RES]
R106  10K  RESISTOR0603-RES  [0603-RES]
R122  4.7k  RESISTOR0603-RES  [0603-RES]
R124  10k  RESISTOR0603-RES  [0603-RES]
R125  1k  RESISTOR0603-RES  [0603-RES]
R131  4.7k  RESISTOR0603-RES  [0603-RES]
R132  510  RESISTOR0603-RES  [0603-RES]
R133  1k  RESISTOR0603-RES  [0603-RES]
R142  10k  RESISTOR0603-RES  [0603-RES]
R143  10k  RESISTOR0603-RES  [0603-RES]
R144  10k  RESISTOR0603-RES  [0603-RES]
U8  TPF410  [S-PQFP-G64]
U9  TXS0102DCUR  [DCU]

### Nets
410_NC: R122.1 U8.49(NC)
+3.3V [net_+3.3V]: R122.2 R124.2 R132.2 R133.2 R142.2 R144.2 U8.1(DVDD) U8.12(DVDD1) U8.18(PVDD) U8.23(TVDD) U8.29(TVDD1) U8.33(DVDD2) ; also sheet 1,4,7
DC_5V [net_DC_5V]: F2.IN ; also sheet 1,2,3,4,7
DKEN: R133.1 U8.35(DKEN)
DSS_ACBIAS: R27.1 ; also sheet 4,6
DSS_D0: R1.1 ; also sheet 4,6
DSS_D1: R2.1 ; also sheet 4,6
DSS_D2: R3.1 ; also sheet 4,6
DSS_D3: R4.1 ; also sheet 4,6
DSS_D4: R6.1 ; also sheet 4,6
DSS_D5: R7.1 ; also sheet 4,6
DSS_D6: R8.1 ; also sheet 4,6
DSS_D7: R9.1 ; also sheet 4,6
DSS_D8: R10.1 ; also sheet 4,6
DSS_D9: R11.1 ; also sheet 4,6
DSS_D10: R12.1 ; also sheet 4,6
DSS_D11: R13.1 ; also sheet 4,6
DSS_D12: R14.1 ; also sheet 4,6
DSS_D13: R15.1 ; also sheet 4,6
DSS_D14: R16.1 ; also sheet 4,6
DSS_D15: R17.1 ; also sheet 4,6
DSS_D16: R18.1 ; also sheet 4,6
DSS_D17: R19.1 ; also sheet 4,6
DSS_D18: R20.1 ; also sheet 4,6
DSS_D19: R21.1 ; also sheet 4,6
DSS_D20: R22.1 ; also sheet 4,6
DSS_D21: R23.1 ; also sheet 4,6
DSS_D22: R24.1 ; also sheet 4,6
DSS_D23: R25.1 ; also sheet 4,6
DSS_HSYNC: R28.1 ; also sheet 4,6
DSS_PCLK: R26.1 ; also sheet 4,6
DSS_VSYNC: R40.1 ; also sheet 4,6
DVI_CLK+: R26.2 U8.57(IDCK+)
DVI_DATA0: R1.2 U8.63(DATA0)
DVI_DATA1: R2.2 U8.62(DATA1)
DVI_DATA2: R3.2 U8.61(DATA2)
DVI_DATA3: R4.2 U8.60(DATA3)
DVI_DATA4: R6.2 U8.59(DATA4)
DVI_DATA5: R7.2 U8.58(DATA5)
DVI_DATA6: R8.2 U8.55(DATA6)
DVI_DATA7: R9.2 U8.54(DATA7)
DVI_DATA8: R10.2 U8.53(DATA8)
DVI_DATA9: R11.2 U8.52(DATA9)
DVI_DATA10: R12.2 U8.51(DATA10)
DVI_DATA11: R13.2 U8.50(DATA11)
DVI_DATA12: R14.2 U8.47(DATA12)
DVI_DATA13: R15.2 U8.46(DATA13)
DVI_DATA14: R16.2 U8.45(DATA14)
DVI_DATA15: R17.2 U8.44(DATA15)
DVI_DATA16: R18.2 U8.43(DATA16)
DVI_DATA17: R19.2 U8.42(DATA17)
DVI_DATA18: R20.2 U8.41(DATA18)
DVI_DATA19: R21.2 U8.40(DATA19)
DVI_DATA20: R22.2 U8.39(DATA20)
DVI_DATA21: R23.2 U8.38(DATA21)
DVI_DATA22: R24.2 U8.37(DATA22)
DVI_DATA23: R25.2 U8.36(DATA23)
DVI_DEN: R27.2 U8.2(DE)
DVI_DSEL: R143.1 U8.14(DSEL/SDA)
DVI_HSYNC: R28.2 U8.4(HSYNC)
DVI_MSEN: R131.1 U8.11(MSEN/P01)
DVI_NDISABLE: R43.1 ; also sheet 4,6
DVI_NRESET: R125.1 U8.13(ISEL/RST)
DVI_VSYNC: R40.2 U8.5(VSYNC)
GND [net_GND]: C126.2 C127.2 HDMI.2(DAT2_S) HDMI.5(DAT1_S) HDMI.8(DAT0_S) HDMI.11(CLK_S) HDMI.17(DDC/CECGND) HDMI.MNT1(P1) HDMI.MNT2(P2) HDMI.MNT3(P3) HDMI.MNT4(P4) R106.1 R125.2 R143.2 U8.16(DGND) U8.17(PGND) U8.20(TGND) U8.26(TGND1) U8.32(TGND2) U8.34(RESERVED) U8.48(DGND1) U8.56(IDCK-) U8.64(DGND2) U8.EP U9.GND ; also sheet 1,2,3,4,6,7
HTPLG: R144.1 U8.9(EDGE/HTPLG)
I2C3_SCL: U9.A1 ; also sheet 4
I2C3_SDA: U9.A2 ; also sheet 4
N$41: R124.1 U8.15(BSEL/SCL)
N$189: R105.1 R106.2 U8.3(VREF)
N$194: HDMI.15(SCL) U9.B1
N$195: HDMI.16(SDA) U9.B2
N$197: C127.1 F2.OUT HDMI.18(+5V) U9.V_CCB
NPD: R43.2 R142.1 U8.10(PD)
TFADJ: R132.1 U8.19(TFADJ)
TXC+: HDMI.10(CLK+) U8.22(TXC+)
TXC-: HDMI.12(CLK-) U8.21(TXC-)
TXD0+: HDMI.7(DAT0+) U8.25(TX0+)
TXD0-: HDMI.9(DAT0-) U8.24(TX0-)
TXD1+: HDMI.4(DAT1+) U8.28(TX1+)
TXD1-: HDMI.6(DAT1-) U8.27(TX1-)
TXD2+: HDMI.1(DAT2+) U8.31(TX2+)
TXD2-: HDMI.3(DAT2-) U8.30(TX2-)
VIO_1.8V [net_VIO_1V8]: C126.1 R105.2 R131.2 U9.OE U9.V_CCA ; also sheet 1,3,4,6,7
Unconnected: HDMI.13(CEC) HDMI.14(NC) HDMI.19(HPLG) U8.6(CTL3/A3/DK3) U8.7(CTL2/A2/DK2) U8.8(CTL1/A1/DK1)

### Notes on the sheet
- OK
- DVI - HDMI

## Sheet 6 of 7
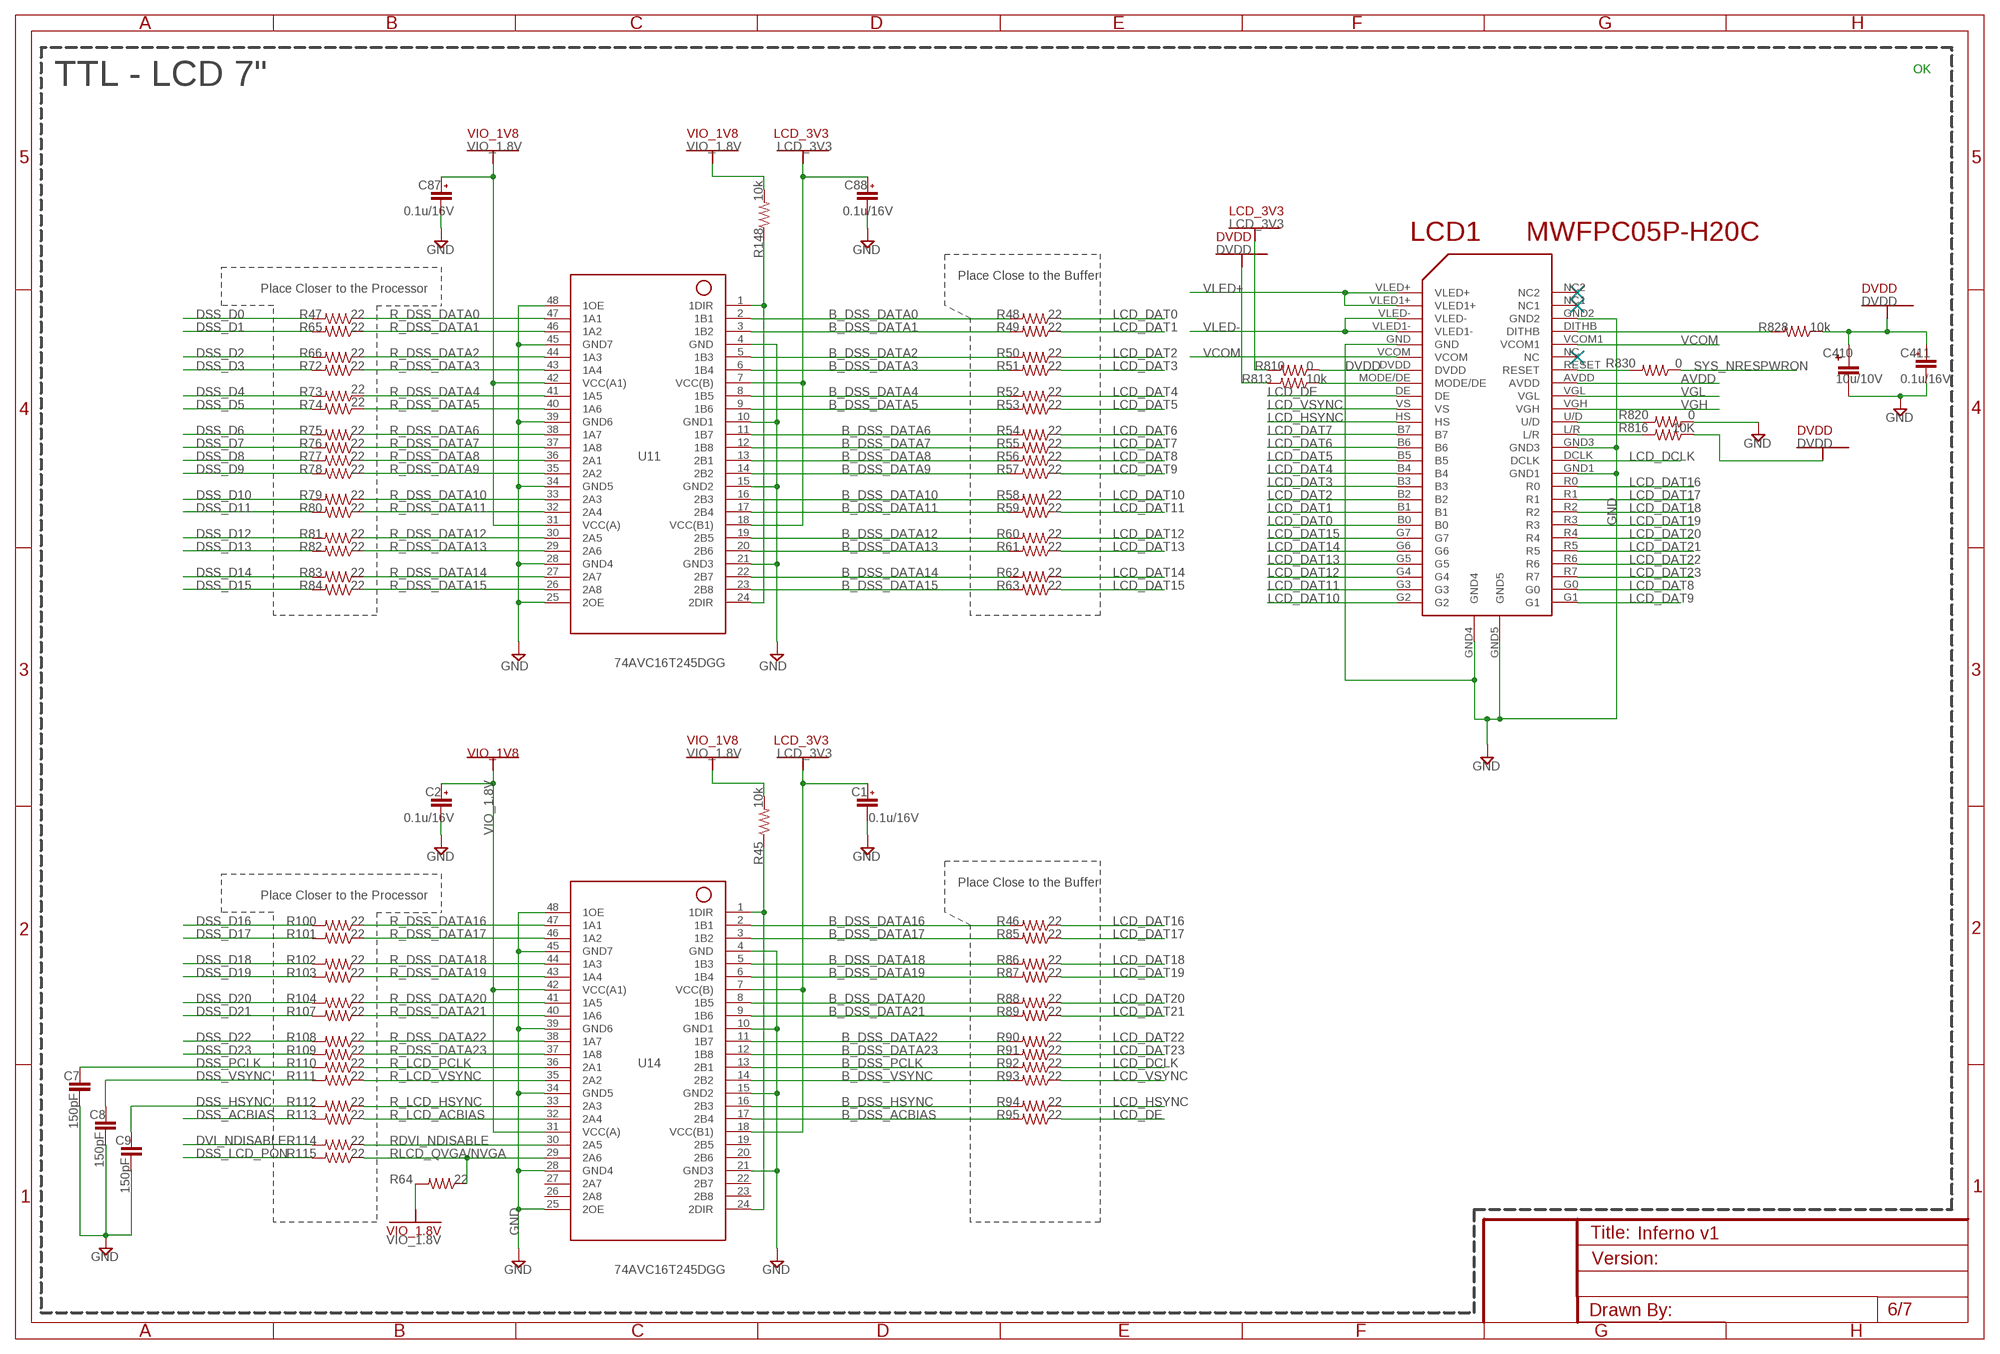
[diagram p5: schematic, sheet 6]

### Parts
C1  0.1u/16V  CAP0805  [0805]
C2  0.1u/16V  CAP0805  [0805]
C7  150pF  CAP0603-CAP  [0603-CAP]
C8  150pF  CAP0603-CAP  [0603-CAP]
C9  150pF  CAP0603-CAP  [0603-CAP]
C87  0.1u/16V  CAP0805  [0805]
C88  0.1u/16V  CAP0805  [0805]
C410  10u/10V  CAP-E-SMD  [0603-CAP]
C411  0.1u/16V  CAP0805  [0805]
LCD1  MWFPC05P-H20C  [50PINS-FFC/FPC-CONNECTOR]
R45  10k  RESISTOR0603-RES  [0603-RES]
R46  22  RESISTOR0603-RES  [0603-RES]
R47  22  RESISTOR0603-RES  [0603-RES]
R48  22  RESISTOR0603-RES  [0603-RES]
R49  22  RESISTOR0603-RES  [0603-RES]
R50  22  RESISTOR0603-RES  [0603-RES]
R51  22  RESISTOR0603-RES  [0603-RES]
R52  22  RESISTOR0603-RES  [0603-RES]
R53  22  RESISTOR0603-RES  [0603-RES]
R54  22  RESISTOR0603-RES  [0603-RES]
R55  22  RESISTOR0603-RES  [0603-RES]
R56  22  RESISTOR0603-RES  [0603-RES]
R57  22  RESISTOR0603-RES  [0603-RES]
R58  22  RESISTOR0603-RES  [0603-RES]
R59  22  RESISTOR0603-RES  [0603-RES]
R60  22  RESISTOR0603-RES  [0603-RES]
R61  22  RESISTOR0603-RES  [0603-RES]
R62  22  RESISTOR0603-RES  [0603-RES]
R63  22  RESISTOR0603-RES  [0603-RES]
R64  22  RESISTOR0603-RES  [0603-RES]
R65  22  RESISTOR0603-RES  [0603-RES]
R66  22  RESISTOR0603-RES  [0603-RES]
R72  22  RESISTOR0603-RES  [0603-RES]
R73  22  RESISTOR0603-RES  [0603-RES]
R74  22  RESISTOR0603-RES  [0603-RES]
R75  22  RESISTOR0603-RES  [0603-RES]
R76  22  RESISTOR0603-RES  [0603-RES]
R77  22  RESISTOR0603-RES  [0603-RES]
R78  22  RESISTOR0603-RES  [0603-RES]
R79  22  RESISTOR0603-RES  [0603-RES]
R80  22  RESISTOR0603-RES  [0603-RES]
R81  22  RESISTOR0603-RES  [0603-RES]
R82  22  RESISTOR0603-RES  [0603-RES]
R83  22  RESISTOR0603-RES  [0603-RES]
R84  22  RESISTOR0603-RES  [0603-RES]
R85  22  RESISTOR0603-RES  [0603-RES]
R86  22  RESISTOR0603-RES  [0603-RES]
R87  22  RESISTOR0603-RES  [0603-RES]
R88  22  RESISTOR0603-RES  [0603-RES]
R89  22  RESISTOR0603-RES  [0603-RES]
R90  22  RESISTOR0603-RES  [0603-RES]
R91  22  RESISTOR0603-RES  [0603-RES]
R92  22  RESISTOR0603-RES  [0603-RES]
R93  22  RESISTOR0603-RES  [0603-RES]
R94  22  RESISTOR0603-RES  [0603-RES]
R95  22  RESISTOR0603-RES  [0603-RES]
R100  22  RESISTOR0603-RES  [0603-RES]
R101  22  RESISTOR0603-RES  [0603-RES]
R102  22  RESISTOR0603-RES  [0603-RES]
R103  22  RESISTOR0603-RES  [0603-RES]
R104  22  RESISTOR0603-RES  [0603-RES]
R107  22  RESISTOR0603-RES  [0603-RES]
R108  22  RESISTOR0603-RES  [0603-RES]
R109  22  RESISTOR0603-RES  [0603-RES]
R110  22  RESISTOR0603-RES  [0603-RES]
R111  22  RESISTOR0603-RES  [0603-RES]
R112  22  RESISTOR0603-RES  [0603-RES]
R113  22  RESISTOR0603-RES  [0603-RES]
R114  22  RESISTOR0603-RES  [0603-RES]
R115  22  RESISTOR0603-RES  [0603-RES]
R148  10k  RESISTOR0603-RES  [0603-RES]
R810  0  RESISTOR0603-RES  [0603-RES]
R813  10k  RESISTOR0603-RES  [0603-RES]
R816  10K  RESISTOR0603-RES  [0603-RES]
R820  0  RESISTOR0603-RES  [0603-RES]
R828  10k  RESISTOR0603-RES  [0603-RES]
R830  0  RESISTOR0603-RES  [0603-RES]
U11  74AVC16T245DGG  [TSSOP48]
U14  74AVC16T245DGG  [TSSOP48]

### Nets
AVDD: LCD1.AVDD ; also sheet 7
B_DSS_ACBIAS: R95.2 U14.17(2B4)
B_DSS_DATA0: R48.2 U11.2(1B1)
B_DSS_DATA1: R49.2 U11.3(1B2)
B_DSS_DATA2: R50.2 U11.5(1B3)
B_DSS_DATA3: R51.2 U11.6(1B4)
B_DSS_DATA4: R52.2 U11.8(1B5)
B_DSS_DATA5: R53.2 U11.9(1B6)
B_DSS_DATA6: R54.2 U11.11(1B7)
B_DSS_DATA7: R55.2 U11.12(1B8)
B_DSS_DATA8: R56.2 U11.13(2B1)
B_DSS_DATA9: R57.2 U11.14(2B2)
B_DSS_DATA10: R58.2 U11.16(2B3)
B_DSS_DATA11: R59.2 U11.17(2B4)
B_DSS_DATA12: R60.2 U11.19(2B5)
B_DSS_DATA13: R61.2 U11.20(2B6)
B_DSS_DATA14: R62.2 U11.22(2B7)
B_DSS_DATA15: R63.2 U11.23(2B8)
B_DSS_DATA16: R46.2 U14.2(1B1)
B_DSS_DATA17: R85.2 U14.3(1B2)
B_DSS_DATA18: R86.2 U14.5(1B3)
B_DSS_DATA19: R87.2 U14.6(1B4)
B_DSS_DATA20: R88.2 U14.8(1B5)
B_DSS_DATA21: R89.2 U14.9(1B6)
B_DSS_DATA22: R90.2 U14.11(1B7)
B_DSS_DATA23: R91.2 U14.12(1B8)
B_DSS_HSYNC: R94.2 U14.16(2B3)
B_DSS_PCLK: R92.2 U14.13(2B1)
B_DSS_VSYNC: R93.2 U14.14(2B2)
DSS_ACBIAS: R113.2 ; also sheet 4,5
DSS_D0: R47.2 ; also sheet 4,5
DSS_D1: R65.2 ; also sheet 4,5
DSS_D2: R66.2 ; also sheet 4,5
DSS_D3: R72.2 ; also sheet 4,5
DSS_D4: R73.2 ; also sheet 4,5
DSS_D5: R74.2 ; also sheet 4,5
DSS_D6: R75.2 ; also sheet 4,5
DSS_D7: R76.2 ; also sheet 4,5
DSS_D8: R77.2 ; also sheet 4,5
DSS_D9: R78.2 ; also sheet 4,5
DSS_D10: R79.2 ; also sheet 4,5
DSS_D11: R80.2 ; also sheet 4,5
DSS_D12: R81.2 ; also sheet 4,5
DSS_D13: R82.2 ; also sheet 4,5
DSS_D14: R83.2 ; also sheet 4,5
DSS_D15: R84.2 ; also sheet 4,5
DSS_D16: R100.2 ; also sheet 4,5
DSS_D17: R101.2 ; also sheet 4,5
DSS_D18: R102.2 ; also sheet 4,5
DSS_D19: R103.2 ; also sheet 4,5
DSS_D20: R104.2 ; also sheet 4,5
DSS_D21: R107.2 ; also sheet 4,5
DSS_D22: R108.2 ; also sheet 4,5
DSS_D23: R109.2 ; also sheet 4,5
DSS_HSYNC: C9.1 R112.2 ; also sheet 4,5
DSS_LCD_PON: R115.2 ; also sheet 4
DSS_PCLK: C7.1 R110.2 ; also sheet 4,5
DSS_VSYNC: C8.1 R111.2 ; also sheet 4,5
DVDD: C410.1 C411.1 LCD1.DVDD R810.1 R813.2 R816.1 R828.1
DVI_NDISABLE: R114.2 ; also sheet 4,5
GND [net_GND]: C1.2 C2.2 C7.2 C8.2 C9.2 C87.2 C88.2 C410.2 C411.2 LCD1.GND LCD1.GND1 LCD1.GND2 LCD1.GND3 LCD1.GND4 LCD1.GND5 R820.1 U11.4(GND) U11.10(GND1) U11.15(GND2) U11.21(GND3) U11.25(2OE) U11.28(GND4) U11.34(GND5) U11.39(GND6) U11.45(GND7) U11.48(1OE) U14.4(GND) U14.10(GND1) U14.15(GND2) U14.21(GND3) U14.25(2OE) U14.28(GND4) U14.34(GND5) U14.39(GND6) U14.45(GND7) U14.48(1OE) ; also sheet 1,2,3,4,5,7
LCD_3V3: C1.1 C88.1 R810.2 U11.7(VCC(B)) U11.18(VCC(B1)) U14.7(VCC(B)) U14.18(VCC(B1)) ; also sheet 7
LCD_DAT0: LCD1.B0 R48.1
LCD_DAT1: LCD1.B1 R49.1
LCD_DAT2: LCD1.B2 R50.1
LCD_DAT3: LCD1.B3 R51.1
LCD_DAT4: LCD1.B4 R52.1
LCD_DAT5: LCD1.B5 R53.1
LCD_DAT6: LCD1.B6 R54.1
LCD_DAT7: LCD1.B7 R55.1
LCD_DAT8: LCD1.G0 R56.1
LCD_DAT9: LCD1.G1 R57.1
LCD_DAT10: LCD1.G2 R58.1
LCD_DAT11: LCD1.G3 R59.1
LCD_DAT12: LCD1.G4 R60.1
LCD_DAT13: LCD1.G5 R61.1
LCD_DAT14: LCD1.G6 R62.1
LCD_DAT15: LCD1.G7 R63.1
LCD_DAT16: LCD1.R0 R46.1
LCD_DAT17: LCD1.R1 R85.1
LCD_DAT18: LCD1.R2 R86.1
LCD_DAT19: LCD1.R3 R87.1
LCD_DAT20: LCD1.R4 R88.1
LCD_DAT21: LCD1.R5 R89.1
LCD_DAT22: LCD1.R6 R90.1
LCD_DAT23: LCD1.R7 R91.1
LCD_DCLK: LCD1.DCLK R92.1
LCD_DE: LCD1.DE R95.1
LCD_HSYNC: LCD1.HS R94.1
LCD_VSYNC: LCD1.VS R93.1
N$35: R148.1 U11.1(1DIR) U11.24(2DIR)
N$43: R45.1 U14.1(1DIR) U14.24(2DIR)
N$87: LCD1.MODE/DE R813.1
N$88: LCD1.L/R R816.2
N$90: LCD1.DITHB R828.2
N$91: LCD1.RESET R830.2
N$92: LCD1.U/D R820.2
R_DSS_DATA0: R47.1 U11.47(1A1)
R_DSS_DATA1: R65.1 U11.46(1A2)
R_DSS_DATA2: R66.1 U11.44(1A3)
R_DSS_DATA3: R72.1 U11.43(1A4)
R_DSS_DATA4: R73.1 U11.41(1A5)
R_DSS_DATA5: R74.1 U11.40(1A6)
R_DSS_DATA6: R75.1 U11.38(1A7)
R_DSS_DATA7: R76.1 U11.37(1A8)
R_DSS_DATA8: R77.1 U11.36(2A1)
R_DSS_DATA9: R78.1 U11.35(2A2)
R_DSS_DATA10: R79.1 U11.33(2A3)
R_DSS_DATA11: R80.1 U11.32(2A4)
R_DSS_DATA12: R81.1 U11.30(2A5)
R_DSS_DATA13: R82.1 U11.29(2A6)
R_DSS_DATA14: R83.1 U11.27(2A7)
R_DSS_DATA15: R84.1 U11.26(2A8)
R_DSS_DATA16: R100.1 U14.47(1A1)
R_DSS_DATA17: R101.1 U14.46(1A2)
R_DSS_DATA18: R102.1 U14.44(1A3)
R_DSS_DATA19: R103.1 U14.43(1A4)
R_DSS_DATA20: R104.1 U14.41(1A5)
R_DSS_DATA21: R107.1 U14.40(1A6)
R_DSS_DATA22: R108.1 U14.38(1A7)
R_DSS_DATA23: R109.1 U14.37(1A8)
R_LCD_ACBIAS: R113.1 U14.32(2A4)
R_LCD_HSYNC: R112.1 U14.33(2A3)
R_LCD_PCLK: R110.1 U14.36(2A1)
R_LCD_VSYNC: R111.1 U14.35(2A2)
RDVI_NDISABLE: R114.1 U14.30(2A5)
RLCD_QVGA/NVGA: R64.1 R115.1 U14.29(2A6)
SYS_NRESPWRON: R830.1 ; also sheet 1,3,4
VCOM: LCD1.VCOM LCD1.VCOM1 ; also sheet 7
VGH: LCD1.VGH ; also sheet 7
VGL: LCD1.VGL ; also sheet 7
VIO_1.8V [net_VIO_1V8]: C2.1 C87.1 R45.2 R64.2 R148.2 U11.31(VCC(A)) U11.42(VCC(A1)) U14.31(VCC(A)) U14.42(VCC(A1)) ; also sheet 1,3,4,5,7
VLED+: LCD1.VLED1+ LCD1.VLED+ ; also sheet 7
VLED-: LCD1.VLED1- LCD1.VLED- ; also sheet 7
Unconnected: LCD1.NC LCD1.NC1 LCD1.NC2 U14.19(2B5) U14.20(2B6) U14.22(2B7) U14.23(2B8) U14.26(2A8) U14.27(2A7)

### Notes on the sheet
- OK
- TTL - LCD 7"
- Place Close to the Buffer
- Place Closer to the Processor
- Place Close to the Buffer
- Place Closer to the Processor

## Sheet 7 of 7
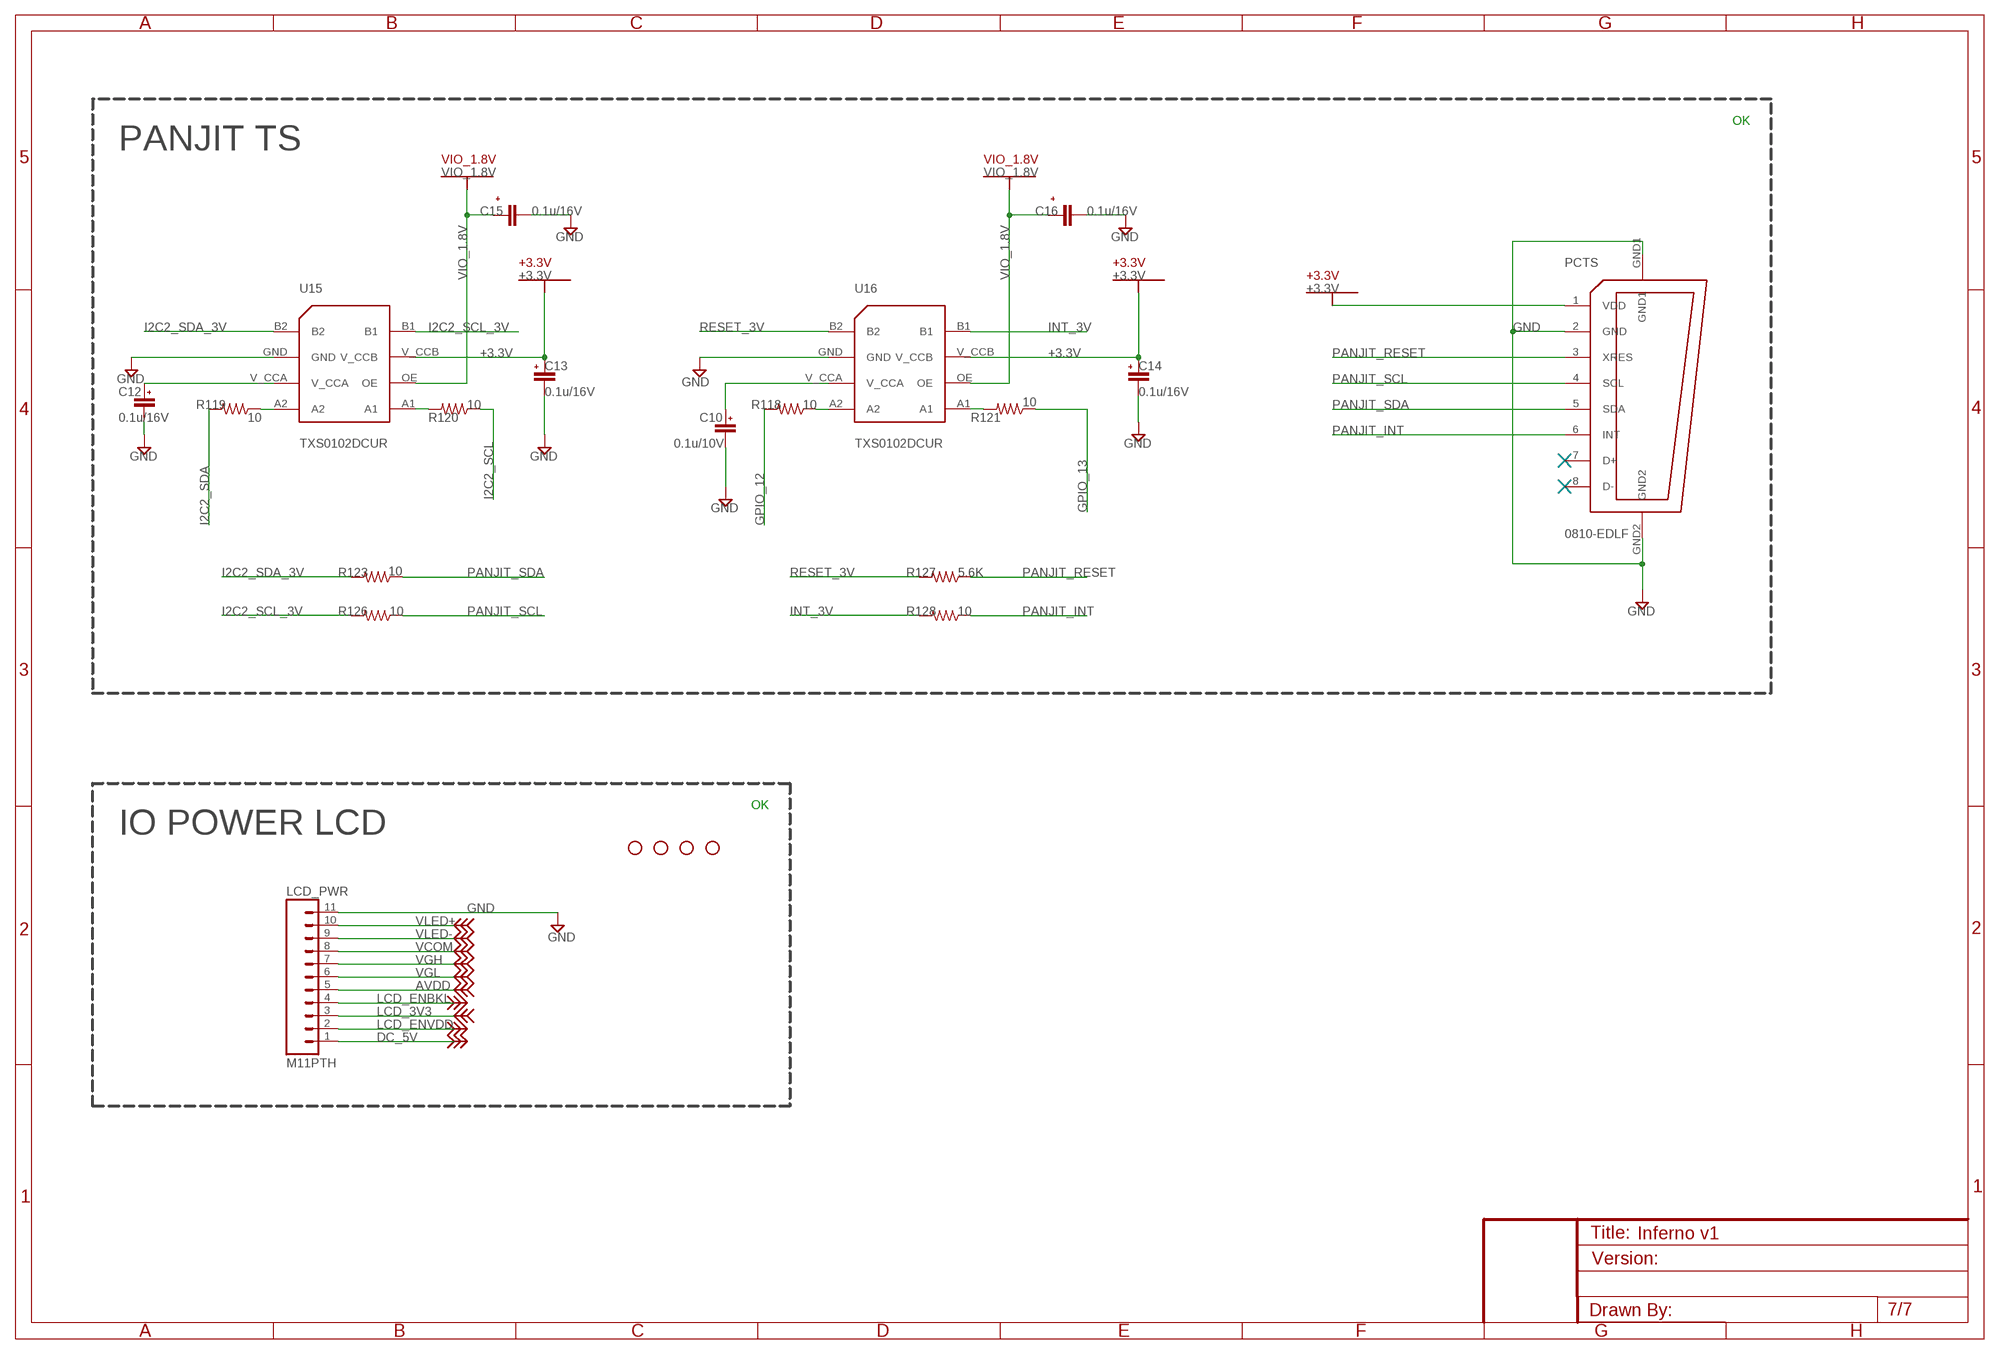
[diagram p6: schematic, sheet 7]

### Parts
C10  0.1u/10V  CAP0805  [0805]
C12  0.1u/16V  CAP0805  [0805]
C13  0.1u/16V  CAP0805  [0805]
C14  0.1u/16V  CAP0805  [0805]
C15  0.1u/16V  CAP0805  [0805]
C16  0.1u/16V  CAP0805  [0805]
LCD_PWR  M11PTH  [1X11]
PCTS  0810-EDLF  [FPC_CONNECTOR]
R118  10  RESISTOR0603-RES  [0603-RES]
R119  10  RESISTOR0603-RES  [0603-RES]
R120  10  RESISTOR0603-RES  [0603-RES]
R121  10  RESISTOR0603-RES  [0603-RES]
R123  10  RESISTOR0603-RES  [0603-RES]
R126  10  RESISTOR0603-RES  [0603-RES]
R127  5.6K  RESISTOR0603-RES  [0603-RES]
R128  10  RESISTOR0603-RES  [0603-RES]
U15  TXS0102DCUR  [DCU]
U16  TXS0102DCUR  [DCU]
U$73  STANDOFF_2.8MM  [STANDOFF_2.8MM]
U$74  STANDOFF_2.8MM  [STANDOFF_2.8MM]
U$75  STANDOFF_2.8MM  [STANDOFF_2.8MM]
U$76  STANDOFF_2.8MM  [STANDOFF_2.8MM]

### Nets
+3.3V [net_+3.3V]: C13.1 C14.1 PCTS.1(VDD) U15.V_CCB U16.V_CCB ; also sheet 1,4,5
AVDD: LCD_PWR.5 ; also sheet 6
DC_5V [net_DC_5V]: LCD_PWR.1 ; also sheet 1,2,3,4,5
GND [net_GND]: C10.2 C12.2 C13.2 C14.2 C15.2 C16.2 LCD_PWR.11 PCTS.2(GND) PCTS.GND1 PCTS.GND2 U15.GND U16.GND ; also sheet 1,2,3,4,5,6
GPIO_12: R118.2 ; also sheet 4
GPIO_13: R121.1 ; also sheet 4
I2C2_SCL: R120.1 ; also sheet 4
I2C2_SCL_3V: R126.2 U15.B1
I2C2_SDA: R119.2 ; also sheet 4
I2C2_SDA_3V: R123.2 U15.B2
INT_3V: R128.2 U16.B1
LCD_3V3: LCD_PWR.3 ; also sheet 6
LCD_ENBKL: LCD_PWR.4 ; also sheet 4
LCD_ENVDD: LCD_PWR.2 ; also sheet 4
N$44: C12.1 U15.V_CCA
N$45: R119.1 U15.A2
N$46: R118.1 U16.A2
N$47: R120.2 U15.A1
N$49: R121.2 U16.A1
N$50: C10.1 U16.V_CCA
PANJIT_INT: PCTS.6(INT) R128.1
PANJIT_RESET: PCTS.3(XRES) R127.1
PANJIT_SCL: PCTS.4(SCL) R126.1
PANJIT_SDA: PCTS.5(SDA) R123.1
RESET_3V: R127.2 U16.B2
VCOM: LCD_PWR.8 ; also sheet 6
VGH: LCD_PWR.7 ; also sheet 6
VGL: LCD_PWR.6 ; also sheet 6
VIO_1.8V [net_VIO_1V8]: C15.1 C16.1 U15.OE U16.OE ; also sheet 1,3,4,5,6
VLED+: LCD_PWR.10 ; also sheet 6
VLED-: LCD_PWR.9 ; also sheet 6
Unconnected: PCTS.7(D+) PCTS.8(D-)

### Notes on the sheet
- OK
- PANJIT TS
- OK
- IO POWER LCD

## Library data of the parts
AUDIO_IN AUDIO_OUT = inferno:STX-300: Phone Connectors 3.5mm Audio Jack STX-300 (Plastic Body, Righ Angle, PCB Mount) Mouser Part #: 806-STX-3000 Manufacturer Part #: STX-3000 Manufacturer: Kycon
B1 B3-B5 B8-B11 B13 = inferno:BEAD-0603: BEAD 0603
B-1 B-2 = inferno:AXK5S00247YG: P5KS Socket - AXK5S00247YG - Board To Board Connectors - BRD 100 POS 0.5mm Connectors for the Omap 3530 board Mouser Part #: 769-AXK5S00247YG Manufacturer Part #: AXK5S00247YG Manufacturer: Panasonic Electric Works
C1 C2 C7-C10 C12-C16 C24-C48 C87 C88 C126-C130 C136-C142 C144 C145 C159 C411 = SparkFun:CAP: Capacitor Standard 0603 ceramic capacitor, and 0.1" leaded capacitor.
C143 C146 C153 C161 C410 = inferno_adan:CAP-E-SMD: Capacitor Electrolitico 0603-SMD
D4-D7 D22-D25 D27-D29 = inferno:DIODES: Diodes facing each other - 0603
D30 = SparkFun:DIODE-SCHOTTKY
DC-IN = inferno_adan:KLDX_0202: Manufacturer: Kycon Mouser Part #: 806-KLDX-0202-B Manufacturer Part #: KLDX-0202-B Product Category: DC Power Connectors RoHS: RoHS Compliant Details Product: Jacks Inside Contact Diameter: 2.5 mm Outside Contact Diameter: 6.3 mm Current Rating: 3.5 A Voltage Rating: 24 V Mounting Angle: Right Angle Mounting Style: PCB Contact Plating: Tin Contact Material: Brass Color: Black Connector Type: DC Power Jack Flammability Rating: UL 94 V-0 Gender: Female Housing Material: PBT Thermoplastic Insulation Resistance: 100 M Ohms Operating Temperature Range: - 25 C to + 85 C
EXPANSIONHEADER = SparkFun:M20: This is just like the LOCK variant in that the holes are staggared by 5 mil, but except for the last two holes. They are not altered from the "standard" footprint layout. This is used for a special purpose on the layout of our Graphic LCD Backpack. Make sure you want to use this device before selecting it for you project!
F1 F2 = inferno:0805L100WR: POLYFUSE® Resettable PTCs 0805L Series Model: 0805L100 Mouser Part #: 576-0805L100 Manufacturer Part #: 0805L100WR
HDMI = inferno_adan:HDMI-19: Manufacturer: Molex Mouser Part #: 538-47151-1001 Manufacturer Part #: 47151-1001 Product Category: HDMI / Displayport / DVI Connectors RoHS: RoHS Compliant Details Product Type: HDMI Gender: Female Number of Positions / Contacts: 19 Mounting Style: PCB Orientation: Right Angle Contact Plating: Gold Color: Black Contact Material: Copper Alloy Voltage Rating: 40 Volts Contact Rating: 0.5 Amp Packaging: Reel Standard Pack Qty: 1050 Termination Style: Solder Part # Aliases: 0471511001
L1 L2 L5 L6 = inferno:L: Inductor
LCD1 = inferno:MWFPC05P-H20C: FFC/FPC connector for 7' display Mouser Part #: 798-FH28E50S05SH05 Manufacturer Part #: FH28E-50S-0.5SH(05) Manufacturer: Hirose Connector Description: FFC / FPC Connectors 50POS 0.5MM SMT GOLD
LCD_PWR = SparkFun:M11: Header 11 Standard 11-pin 0.1" header. Use with straight break away headers (SKU : PRT-00116), right angle break away headers (PRT-00553), swiss pins (PRT-00743), machine pins (PRT-00117), and female headers (PRT-00115).
MICROSD = inferno_adan:MICRO-SD-MOLEX: Manufacturer: Molex Mouser Part #: 538-104031-0811 Manufacturer Part #: 104031-0811 Product Category: Memory Card Connectors RoHS: RoHS Compliant Details Product: Card Connectors Card Type: microSD Pitch: 1.1 mm Orientation: Right Angle Mounting Style: SMD/SMT Termination Style: Solder Number of Rows: 1 Number of Contacts: 8 Current Rating: 0.5 Amps Voltage Rating: 10 Volts Contact Material: Phosphor Bronze Contact Plating: Gold Features: Detect Switch Flammability Rating: UL 94 V-0 Height: 1.42 mm Housing Material: Liquid Crystal Polymer (LCP) Insertion - Extraction Style: Push-Pull Length: 11.4 mm Mating Cycles: 10000 Mounting Angle: Right Mounting Type: Standard Number of Positions / Contacts: 8
PCTS = inferno:0810-EDLF: 0810EDLF - TouchScreen Connector Mouser Part #: 649-162827-0810EDLF Manufacturer Part #: 10062827-0810EDLF Manufacturer: FCI Description: FFC / FPC Connectors 8P SIDE ENT SMT ZIF LWR CONTACT RA
R1-R66 R69 R72-R95 R100-R115 R118-R128 R131-R133 R142-R144 R148 R164 R176 R177 R180-R184 R186 R188 R189 R199-R209 R211 R224 R226 R238 R239 R254 R255 R258 R259 R810 R813 R816 R820 R828 R830 = SparkFun:RESISTOR: Resistor Basic schematic elements and footprints for 0603, 1206, and PTH resistors.
RESET USER = inferno_adan:TAC_SWITCH: Momentary Switch Button commonly used for reset or general input. Spark Fun Electronics SKU : COM-00097
SPK_LEFT SPK_RIGTH = SparkFun:M02: Header 2 Standard 2-pin 0.1" header. Use with straight break away headers (SKU : PRT-00116), right angle break away headers (PRT-00553), swiss pins (PRT-00743), machine pins (PRT-00117), and female headers (PRT-00115). Molex polarized connector foot print use with SKU : PRT-08233 with associated crimp pins and housings.
U2 = inferno:TPA2012D2RTJR: 2.1 W/CH STEREO FILTER-FREE CLASS-D AUDIO POWER AMPLIFIER ( Texa Instruments ) TPA2012D2RTJR Package: RTJ Mouser Part #: 595-TPA2012D2RTJR Manufacturer Part #: TPA2012D2RTJR
U3 = inferno:ADM3202ARUZ: Low Power, 3.3 V, RS-232 Line Drivers/Receivers Manufacturer Part Number: ADM3202ARUZ Manufacturer: Analog Devices Inc Digi-Key Part #: ADM3202ARUZ-ND Package: 16-TSSOP
U4 = inferno_adan:LD1117S18TR: Manufacturer: STMicroelectronics Mouser Part #: 511-LD1117S18-TR Manufacturer Part #: LD1117S18TR Product Category: Low Dropout (LDO) Regulators RoHS: RoHS Compliant Details Number of Outputs: 1 Polarity: Positive Input Voltage MAX: 15 V Output Voltage: 1.8 V Output Type: Fixed Dropout Voltage (Max): 1.1 V Output Current: 950 mA Line Regulation: 6 mV Load Regulation: 10 mV Voltage Regulation Accuracy: 1 % Maximum Power Dissipation: 12 W Maximum Operating Temperature: + 150 C Mounting Style: SMD/SMT Package / Case: SOT-223 Packaging: Reel Minimum Operating Temperature: 0 C
U5 = inferno_adan:LD1117S33TR: Manufacturer: STMicroelectronics Mouser Part #: 511-LD1117S33 Manufacturer Part #: LD1117S33TR Product Category: Low Dropout (LDO) Regulators RoHS: RoHS Compliant Details Number of Outputs: 1 Polarity: Positive Input Voltage MAX: 15 V Output Voltage: 3.3 V Output Type: Fixed Dropout Voltage (Max): 1.1 V Output Current: 950 mA Line Regulation: 6 mV Load Regulation: 10 mV Voltage Regulation Accuracy: 1 % Maximum Power Dissipation: 12 W Maximum Operating Temperature: + 150 C Mounting Style: SMD/SMT Package / Case: SOT-223 Packaging: Reel Minimum Operating Temperature: 0 C
U8 = inferno_adan:TPF410: Manufacturer: Texas Instruments Mouser Part #: 595-TFP410PAP Manufacturer Part #:TFP410PAP Product Category: Display Interface IC RoHS: RoHS Compliant Details Supply Current: 250 mA Operating Temperature Range: 0 C to 70 C Package / Case: HTQFP EP-64 (10 mm x 10 mm x 1 mm ) Packaging: Tray Mounting Style: SMD/SMT Operating Supply Voltage: 3 V to 3.6 V Standard Pack Qty: 160 Type: Display Interface IC
U9 U12 U15 U16 = inferno:TXS0102DCUR: IC VOLT-LEVEL TRANSLATOR 8 Manufacturer Part #: TXS0102DCUR Digi-Key Part #: 296-21931-2-ND Package: DCU
U10 = inferno_adan:USB3320C-EZK: Manufacturer: SMSC Manufacturer Part #: USB3320C-EZK-TR Product Category: USB Interface IC USB Interface IC High Speed USB 1.8V ULP
U11 U14 = inferno_adan:74AVC16T245DGG: Manufacturer: NXP Mouser Part #: 771-74AVC16T245DG118 Manufacturer Part #: 74AVC16T245DGG,118 RoHS: RoHS Compliant Details Logic Family: 74AVC Number of Channels per Chip: 2 Propagation Delay Time: 6 ns, 11.8 ns Supply Voltage (Max): 3.6 V Supply Voltage (Min): 0.8 V Maximum Operating Temperature: + 125 C Package / Case: TSSOP-48 Packaging: Reel Maximum Power Dissipation: 500 mW Minimum Operating Temperature: - 40 C Mounting Style: SMD/SMT
U40 = inferno:SN74LVC1G08DBVR: SN74LVC1G08DBVR ( AND GATE ) Mouser Part #: 595-SN74LVC1G08DBVR Manufacturer Part #: SN74LVC1G08DBVR Package type: SOT-23 Package Drawing: DBV
U$73-U$76 = alteio:STANDOFF_2.8MM
UART_CMD = SparkFun:M05: Header 5 Standard 5-pin 0.1" header. Use with straight break away headers (SKU : PRT-00116), right angle break away headers (PRT-00553), swiss pins (PRT-00743), machine pins (PRT-00117), and female headers (PRT-00115). Molex polarized connector foot print use with SKU : PRT-08230 with associated crimp pins and housings.
USB-CLIENT = inferno_adan:MUSB-B-ST: Manufacturer: TE Connectivity Mouser Part #: 571-1734035-1 Manufacturer Part #: 1734035-1 Product Category: USB Connectors RoHS: RoHS Compliant Details Product: Mini USB Type B Connectors Standard: USB Number of Ports: 1 Pitch: 0.8 mm Contact Plating: Gold Contact Material: Phosphor Bronze Gender: Female Current Rating: 1 A Mounting Style: SMD/SMT Termination Style: Solder Pad Connector Type: Mini USB Type B Receptacle Color: Black Features: Without Locking Feature Flammability Rating: UL 94 V-0 Insulation Resistance: 100 MOhms Mounting Angle: Right Number of Positions / Contacts: 5 Operating Temperature Range: 0 C to + 50 C Packaging: Ammo Pack Series: DisplayPort Receptacles and Cable Assemblies Standard Pack Qty: 8400 Voltage Rating: 30 VAC
USB-HOST = inferno:MINI-USB-A-S-RA: Mini USB Female ConnectorType A Recep., Single,Surface Mount Mouser Part #: 575-89643005 Manufacturer Part #: 896-43-005-00-100001 Manufacturer: Mill-Max Description: USB Connectors RCPT MINI TYPE A SMT

## Net classes
0 net_DATA: width 0.152 mm, drill 0.381 mm
1 net_DC_5V: width 0.61 mm, drill 0.61 mm
2 net_MAIN_DC: width 0.61 mm, drill 0.61 mm
3 net_VIO_1V8: width 0.406 mm, drill 0.406 mm
4 net_+3.3V: width 0.406 mm, drill 0.406 mm
5 net_GND: width 0.61 mm, drill 0.508 mm
6 net_A_GND: width 0.61 mm, drill 0.508 mm
7 net_USBC1_GND: width 0.61 mm, drill 0.508 mm